# EAGLE schematic EEZ DIB DCP405 r4B2 (EAGLE 7.2.0)
Assembly variants: Farnell, TME

## Sheet 1 of 6: Power pre-regulator
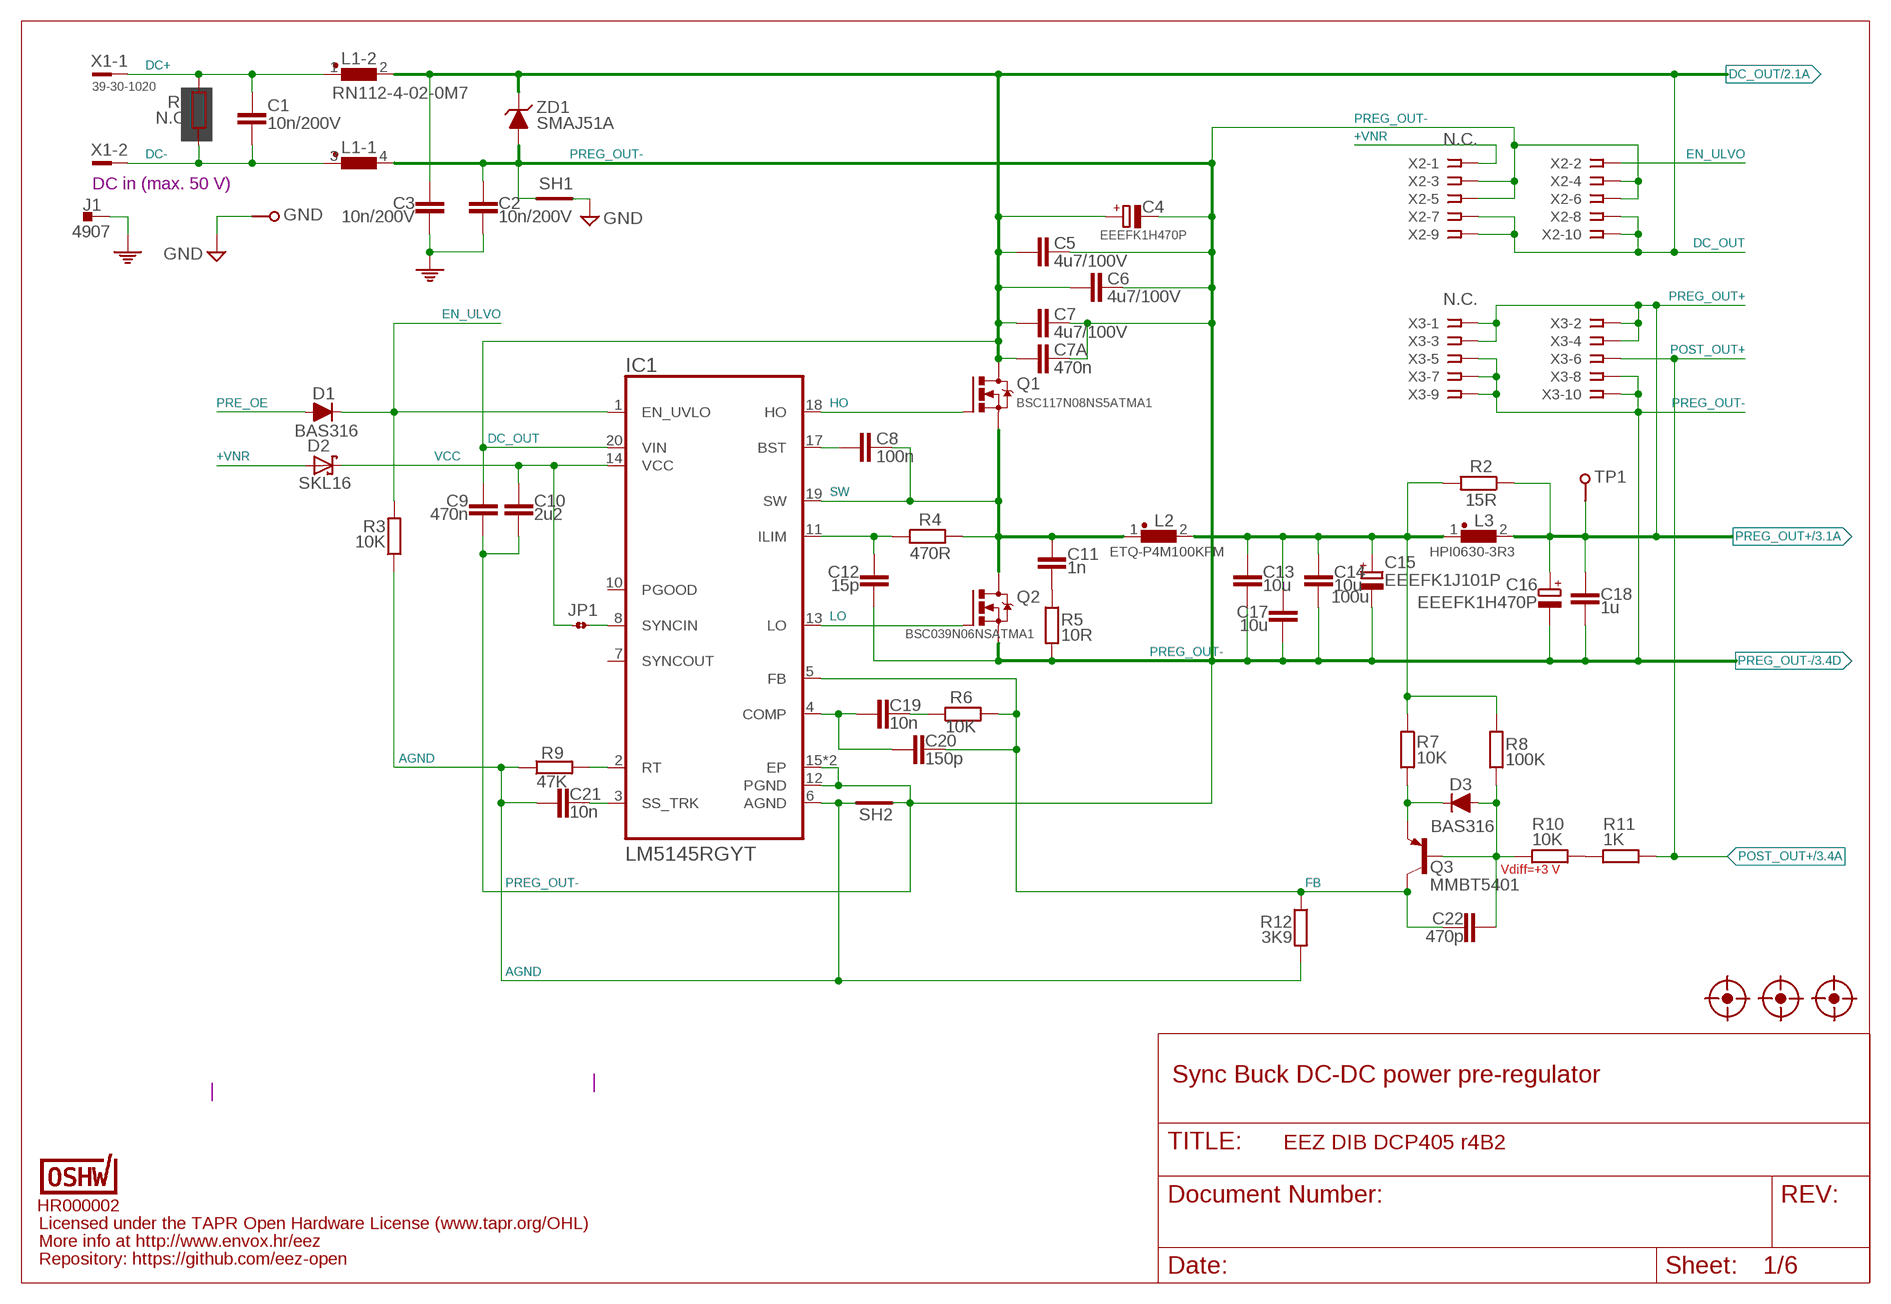
[diagram p0: schematic, sheet 1]

### Parts
C1  10n/200V  C-EUC1206  [C1206]
C2  10n/200V  C-EUC1206  [C1206]
C3  10n/200V  C-EUC1206  [C1206]
C4  EEEFK1H470P  ECAPSMD8.3MM/HA0  [CAPAE830X1050N]
C5  4u7/100V  C-EUC1210  [C1210]
C6  4u7/100V  C-EUC1210  [C1210]
C7  4u7/100V  C-EUC1210  [C1210]
C7A  470n  C-EUC0805  [C0805]
C8  100n  C-EUC0603  [C0603]
C9  470n  C-EUC0805  [C0805]
C10  2u2  C-EUC1206  [C1206]
C11  1n  C-EUC0805  [C0805]
C12  15p  C-EUC0805  [C0805]
C13  10u  C-EUC1210  [C1210]
C14  10u  C-EUC1210  [C1210]
C15  EEEFK1J101P  ECAP10X10  [CAPAE1030X1050N]
C16  EEEFK1H470P  ECAPSMD8.3MM/HA0  [CAPAE830X1050N]
C17  10u  C-EUC1210  [C1210]
C18  1u  C-EUC0805  [C0805]
C19  10n  C-EUC0805  [C0805]
C20  150p  C-EUC0805  [C0805]
C21  10n  C-EUC0805  [C0805]
C22  470p  C-EUC0805  [C0805]
D1  BAS316  DIODESOD323R  [SOD323-R]
D2  SKL16  SCHOTTKYSOD123  [SOD123]
D3  BAS316  DIODESOD323R  [SOD323-R]
FM1  FIDUCIAL_2  [FIDUCIAL_DUAL]
FM2  FIDUCIAL_2  [FIDUCIAL_DUAL]
FM3  FIDUCIAL_2  [FIDUCIAL_DUAL]
GND  PCB_TEST_TABSHIELD  [PCB_SHIELD_TAB]
IC1  LM5145RGYT  LM5145RGYR  [RGY0020B]
J1  4907  PCB_TAB-4907  [PCB_TAB-4907]
JP1  JP2-CUT-0805  [R_0805]
L1  RN112-4-02-0M7  RN112  [RN112]
L2  ETQ-P4M100KFM  PANASONIC_ETQ-P4_KFM  [PANASONIC_ETQ-P4_KFM]
L3  HPI0630-3R3  COILCRAFT_HPI0630  [COILCRAFT_HPI0630]
OSHWA  HR000002  OSHWA-CERT-SMALL  [CERT-SMALL-SILK]
Q1  BSC117N08NS5ATMA1  N-MOSFETTDSON-8  [TDSON-8]
Q2  BSC039N06NSATMA1  N-MOSFETTDSON-8  [TDSON-8]
Q3  MMBT5401  BC857B-PNP-SOT23-BEC  [SOT23-BEC]
R1  N.C.  R-EU_R2512  [R2512]
R2  15R  R-EU_R2010  [R2010]
R3  10K  R-EU_R0805  [R0805]
R4  470R  R-EU_R0805  [R0805]
R5  10R  R-EU_R1206  [R1206]
R6  10K  R-EU_R0805  [R0805]
R7  10K  R-EU_R0805  [R0805]
R8  100K  R-EU_R0805  [R0805]
R9  47K  R-EU_R0805  [R0805]
R10  10K  R-EU_R0805  [R0805]
R11  1K  R-EU_R0805  [R0805]
R12  3K9  R-EU_R0805  [R0805]
SH1  SHORTNOHOLE  [SHORT_NOHOLE]
SH2  SHORTNOHOLE  [SHORT_NOHOLE]
TP1  TEST-PIN_0.9MM  [TEST-PIN_0.9MM]
X1  39-30-1020  MINIFIT_39301020  [MINIFIT_39301020]
X2  N.C.  SSW-105-02-S-D  [SSW-105-02-S-D]
X3  N.C.  SSW-105-02-S-D  [SSW-105-02-S-D]
ZD1  SMAJ51A  P6SMB68A  [DO214AA]

### Nets
+VNR: D2.A X2.1 ; also sheet 2
AGND: C21.2 IC1.6(AGND) R3.1 R9.1 R12.2 SH2.1(GND_A)
DC+: C1.2 L1.1 R1.2 X1.1
DC-: C1.1 L1.3 R1.1 X1.2
DC_OUT: C3.2 C4.+ C5.1 C6.1 C7.1 C7A.2 C9.2 IC1.20(VIN) L1.2 Q1.5(D) Q1.6(D) Q1.7(D) Q1.8(D) X2.7 X2.8 X2.9 X2.10 ZD1.C ; also sheet 2,3
EN_ULVO: D1.C IC1.1(EN_UVLO) R3.2 X2.2
FB: C20.1 C22.1 IC1.5(FB) Q3.C R6.2 R12.1
GND: GND.1 SH1.2(GND_B) ; also sheet 2,3,4,5,6
HO: IC1.18(HO) Q1.4(G)
L_OUT: C13.1 C14.1 C15.+ C17.1 L2.2 L3.1 R2.2 R7.1 R8.1
LO: IC1.13(LO) Q2.4(G)
N$7: IC1.8(SYNCIN) JP1.2
N$8: R10.2 R11.1
N$16: D3.C Q3.E R7.2
N$38: C19.1 R6.1
N$40: C8.1 IC1.17(BST)
N$43: IC1.2(RT) R9.2
N$45: C19.2 C20.2 IC1.4(COMP)
N$46: C12.1 IC1.11(ILIM) R4.1
N$53: C21.1 IC1.3(SS_TRK)
N$59: C11.2 R5.2
N$79: C22.2 D3.A Q3.B R8.2 R10.1
PE: C2.2 C3.1 J1.1 J1.2 ; also sheet 4
POST_OUT+: R11.2 X3.6 ; also sheet 3,4,5
PRE_OE: D1.A ; also sheet 6
PREG_OUT+: C16.+ C18.2 L3.2 R2.1 TP1.1 X3.1 X3.2 X3.3 X3.4 ; also sheet 3
PREG_OUT-: C2.1 C4.- C5.2 C6.2 C7.2 C7A.1 C9.1 C10.1 C12.2 C13.2 C14.2 C15.- C16.- C17.2 C18.1 IC1.12(PGND) IC1.15(EP) IC1.21(EP) L1.4 Q2.1(S) Q2.2(S) Q2.3(S) R5.1 SH1.1(GND_A) SH2.2(GND_B) X2.3 X2.4 X2.5 X2.6 X3.5 X3.7 X3.8 X3.9 X3.10 ZD1.A ; also sheet 3
SW: C8.2 C11.1 IC1.19(SW) L2.1 Q1.1(S) Q1.2(S) Q1.3(S) Q2.5(D) Q2.6(D) Q2.7(D) Q2.8(D) R4.2
VCC: C10.2 D2.C IC1.14(VCC) JP1.1
Unconnected: IC1.7(SYNCOUT) IC1.10(PGOOD)

### Notes on the sheet
- DC in (max. 50 V)
- 100u
- Vdiff=+3 V
- Sync Buck DC-DC power pre-regulator
- Licensed under the TAPR Open Hardware License (www.tapr.org/OHL)
- More info at http://www.envox.hr/eez
- Repository: https://github.com/eez-open

## Sheet 2 of 6: Bias power, DIB interface
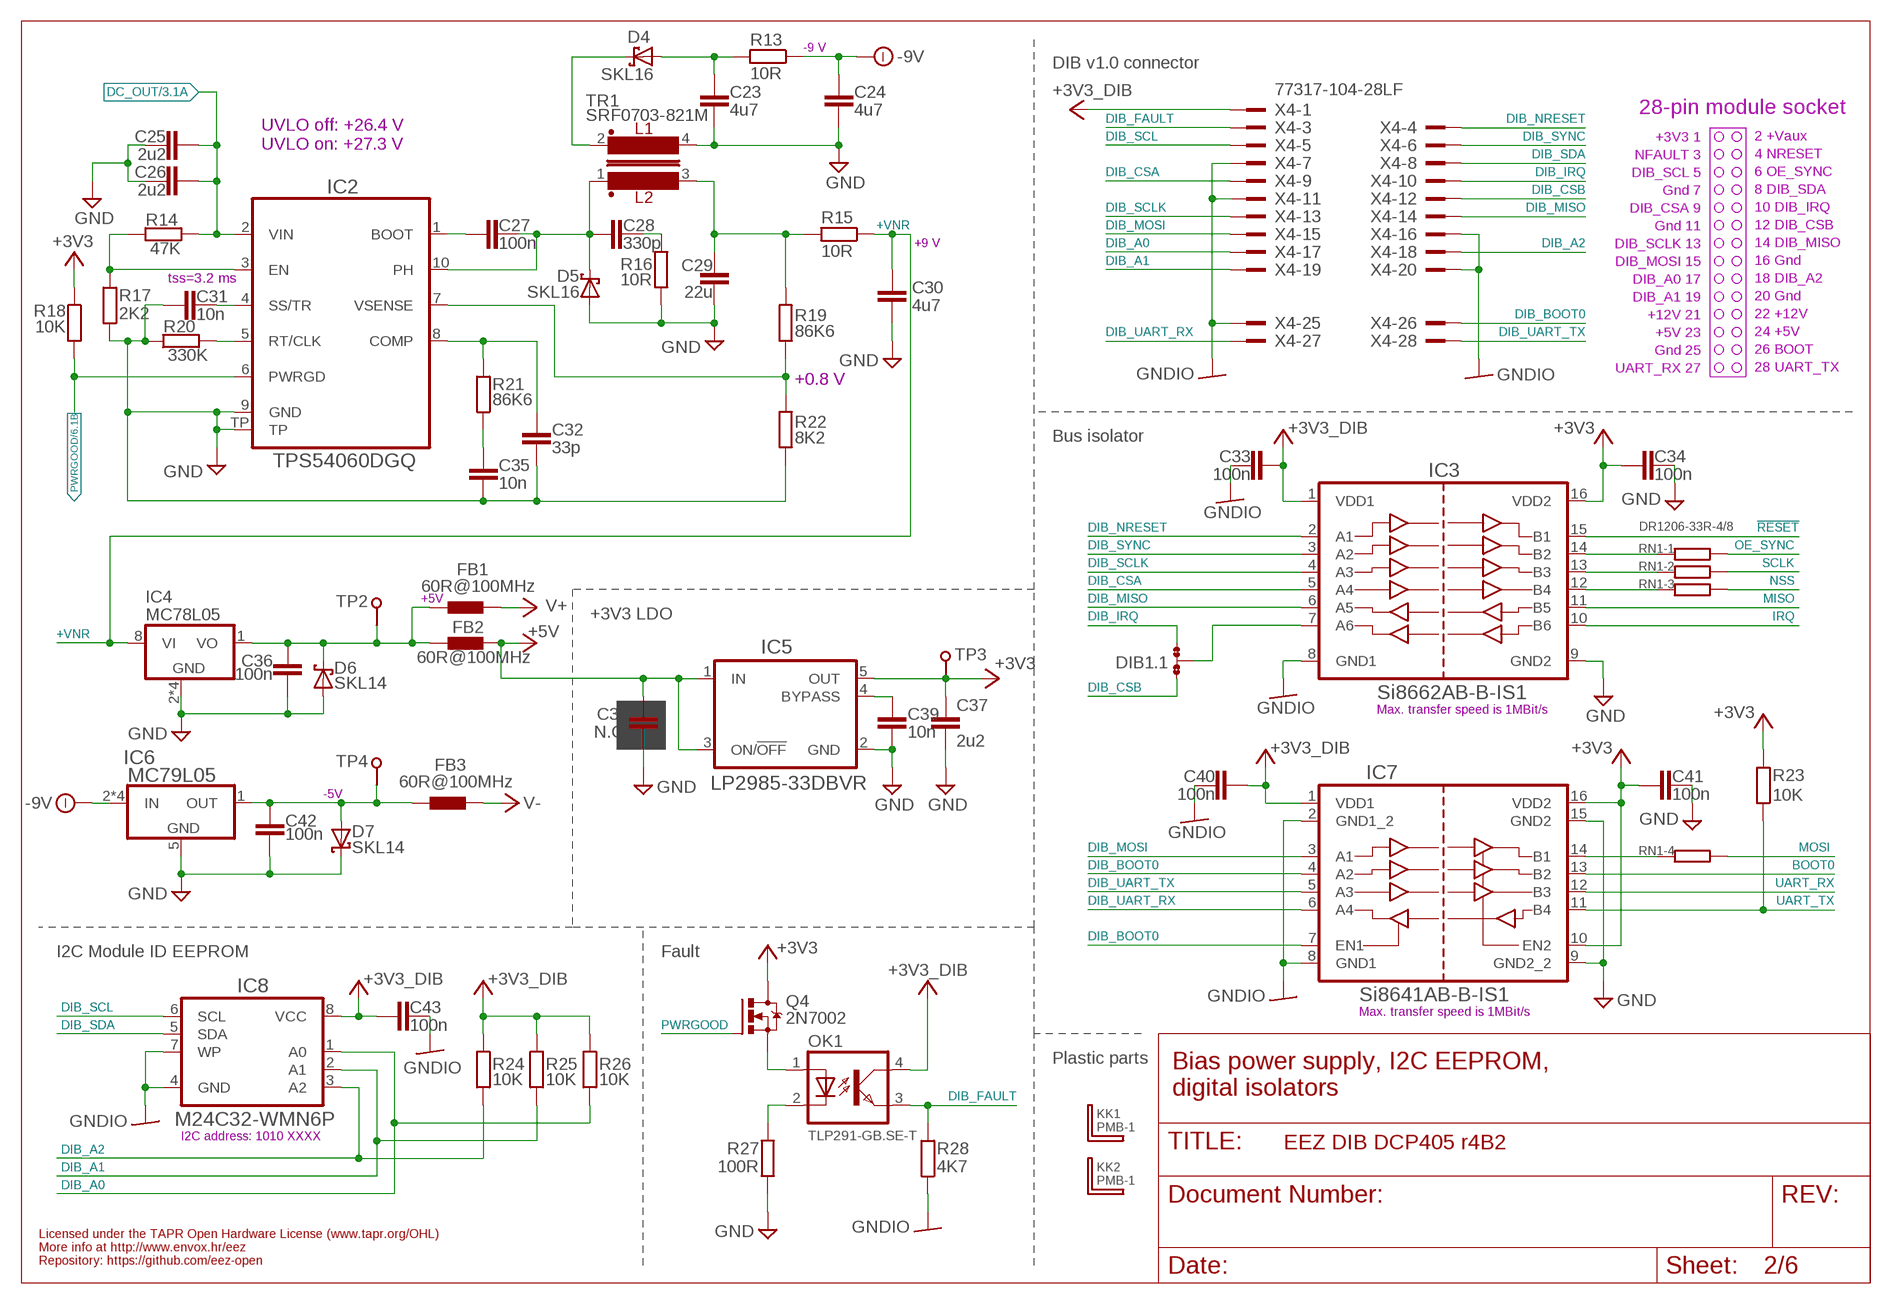
[diagram p1: schematic, sheet 2]

### Parts
C23  4u7  C-EUC1206  [C1206]
C24  4u7  C-EUC1206  [C1206]
C25  2u2  C-EUC1206  [C1206]
C26  2u2  C-EUC1206  [C1206]
C27  100n  C-EUC0603  [C0603]
C28  330p  C-EUC0805  [C0805]
C29  22u  C-EUC1210  [C1210]
C30  4u7  C-EUC1206  [C1206]
C31  10n  C-EUC0805  [C0805]
C32  33p  C-EUC0805  [C0805]
C33  100n  C-EUC0603  [C0603]
C34  100n  C-EUC0603  [C0603]
C35  10n  C-EUC0805  [C0805]
C36  100n  C-EUC0603  [C0603]
C37  2u2  C-EUC1206  [C1206]
C38  N.C.  C-EUC0805  [C0805]
C39  10n  C-EUC0805  [C0805]
C40  100n  C-EUC0603  [C0603]
C41  100n  C-EUC0603  [C0603]
C42  100n  C-EUC0603  [C0603]
C43  100n  C-EUC0603  [C0603]
D4  SKL16  SCHOTTKYSOD123  [SOD123]
D5  SKL16  SCHOTTKYSOD123  [SOD123]
D6  SKL14  SCHOTTKYSOD123  [SOD123]
D7  SKL14  SCHOTTKYSOD123  [SOD123]
DIB1.1  JP3-CUT-0805-ROTATED  [JP3-0805-CUT2]
FB1  60R@100MHz  FERRITE_BEAD0603  [BEAD0603]
FB2  60R@100MHz  FERRITE_BEAD0603  [BEAD0603]
FB3  60R@100MHz  FERRITE_BEAD0603  [BEAD0603]
IC2  TPS54060DGQ  [SOP50P490X110-11N]
IC3  Si8662AB-B-IS1  SI8662NSOIC-16  [SOIC-16]
IC4  MC78L05  MC78LXXSOIC8  [SOIC127P600X173-8N]
IC5  LP2985-33DBVR  LP2985  [SOT95P270X145-5N]
IC6  MC79L05  MC79LXXSOIC  [SOIC127P600X173-8N]
IC7  Si8641AB-B-IS1  SI8641NSOIC-16  [SOIC-16]
IC8  M24C32-WMN6P  AT24CXXSOIC8  [SOIC127P600X173-8N]
KK1  PMB-1  PCB-MB  [PCB-MB]
KK2  PMB-1  PCB-MB  [PCB-MB]
OK1  TLP291-GB.SE-T  TLP291  [SO4]
Q4  2N7002  [SOT103P240X110-3N]
R13  10R  R-EU_R1206  [R1206]
R14  47K  R-EU_R0805  [R0805]
R15  10R  R-EU_R1206  [R1206]
R16  10R  R-EU_R1206  [R1206]
R17  2K2  R-EU_R0805  [R0805]
R18  10K  R-EU_R0805  [R0805]
R19  86K6  R-EU_R0805  [R0805]
R20  330K  R-EU_R0805  [R0805]
R21  86K6  R-EU_R0805  [R0805]
R22  8K2  R-EU_R0805  [R0805]
R23  10K  R-EU_R0805  [R0805]
R24  10K  R-EU_R0805  [R0805]
R25  10K  R-EU_R0805  [R0805]
R26  10K  R-EU_R0805  [R0805]
R27  100R  R-EU_R0805  [R0805]
R28  4K7  R-EU_R0805  [R0805]
RN1  DR1206-33R-4/8  R_ARRAY4  [CAY16]
TP2  TEST-PIN_0.9MM  [TEST-PIN_0.9MM]
TP3  TEST-PIN_0.9MM  [TEST-PIN_0.9MM]
TP4  TEST-PIN_0.9MM  [TEST-PIN_0.9MM]
TR1  SRF0703-821M  BOURNS_SRF0703INV  [SRF0703]
X4  77317-104-28LF  [77317-104-28LF]

### Nets
!RESET: IC3.15(B1) ; also sheet 6
+3V3: C34.2 C37.1 C41.2 IC3.16(VDD2) IC5.5(OUT) IC7.10(EN2) IC7.16(VDD2) Q4.3(D) R18.1 R23.2 TP3.1 ; also sheet 3,4,5,6
+3V3_DIB: C33.1 C40.1 C43.2 IC3.1(VDD1) IC7.1(VDD1) IC8.8(VCC) OK1.4(COL) R24.1 R25.1 R26.1 X4.1
+5V: C38.2 FB2.P$2 IC5.1(IN) IC5.3(ON/!OFF) ; also sheet 4,5,6
+5VOUT: C36.1 D6.C FB1.P$1 FB2.P$1 IC4.1(VO) TP2.1
+VNR: C30.1 IC4.8(VI) R15.1 ; also sheet 1
-9V: C24.1 IC6.2(IN) IC6.3(IN) IC6.6(IN) IC6.7(IN) R13.1 ; also sheet 3
BOOT0: IC7.13(B2) ; also sheet 6
DC_OUT: C25.1 C26.1 IC2.2(VIN) R14.2 ; also sheet 1,3
DIB_A0: IC8.1(A0) R26.2 X4.17
DIB_A1: IC8.2(A1) R25.2 X4.19
DIB_A2: IC8.3(A2) R24.2 X4.18
DIB_BOOT0: IC7.4(A2) IC7.7(EN1) X4.26
DIB_CSA: IC3.5(A4) X4.9
DIB_CSB: DIB1.1.NO X4.12
DIB_FAULT: OK1.3(EMIT) R28.2 X4.3
DIB_IRQ: DIB1.1.NC X4.10
DIB_MISO: IC3.6(A5) X4.14
DIB_MOSI: IC7.3(A1) X4.15
DIB_NRESET: IC3.2(A1) X4.4
DIB_SCL: IC8.6(SCL) X4.5
DIB_SCLK: IC3.4(A3) X4.13
DIB_SDA: IC8.5(SDA) X4.8
DIB_SYNC: IC3.3(A2) X4.6
DIB_UART_RX: IC7.6(A4) X4.27
DIB_UART_TX: IC7.5(A3) X4.28
GND: C23.2 C24.2 C25.2 C26.2 C29.2 C30.2 C31.2 C32.1 C34.1 C35.1 C36.2 C37.2 C38.1 C39.1 C41.1 C42.1 D5.A D6.A D7.C IC2.9(GND) IC2.TP IC3.9(GND2) IC4.2(GND) IC4.3(GND) IC4.6(GND) IC4.7(GND) IC5.2(GND) IC6.5(GND) IC7.9(GND2_2) IC7.15(GND2) R16.1 R17.1 R20.1 R22.1 R27.1 TR1.4 ; also sheet 1,3,4,5,6
GNDIO: C33.2 C40.2 C43.1 IC3.8(GND1) IC7.2(GND1_2) IC7.8(GND1) IC8.4(GND) IC8.7(WP) R28.1 X4.7 X4.11 X4.16 X4.20 X4.25
IRQ: IC3.10(B6) ; also sheet 6
MISO: IC3.11(B5) ; also sheet 6
MOSI: RN1.5 ; also sheet 6
N$25: C39.2 IC5.4(BYPASS)
N$26: C28.2 R16.2
N$29: C42.2 D7.A FB3.P$1 IC6.1(OUT) TP4.1
N$34: IC2.3(EN) R14.1 R17.2
N$41: C31.1 IC2.4(SS/TR)
N$48: IC2.5(RT/CLK) R20.2
N$50: C32.2 IC2.8(COMP) R21.2
N$51: C35.2 R21.1
N$60: C27.2 IC2.1(BOOT)
N$62: IC2.7(VSENSE) R19.1 R22.2
N$72: OK1.2(C) R27.2
N$78: OK1.1(A) Q4.2(S)
N$110: IC3.14(B2) RN1.1
N$111: IC3.13(B3) RN1.2
N$112: IC3.12(B4) RN1.3
N$153: IC7.14(B1) RN1.4
N$179: C23.1 D4.A R13.2
N$2424: DIB1.1.COM IC3.7(A6)
NSS: RN1.6 ; also sheet 6
OE_SYNC: RN1.8 ; also sheet 6
PH: C27.1 C28.1 D5.C IC2.10(PH) TR1.1
PWRGOOD: IC2.6(PWRGD) Q4.1(G) R18.2 ; also sheet 6
SCLK: RN1.7 ; also sheet 6
UART_RX: IC7.12(B3) ; also sheet 6
UART_TX: IC7.11(B4) R23.1 ; also sheet 6
V+: FB1.P$2 ; also sheet 3,4,5,6
V-: FB3.P$2 ; also sheet 3,4,5
VOUT+: C29.1 R15.2 R19.2 TR1.3
VOUT-: D4.C TR1.2
Unconnected: X4.2 X4.21 X4.22 X4.23 X4.24

### Notes on the sheet
- -9 V
- DIB v1.0 connector
- 28-pin module socket
- +3V3 1
- 2 +Vaux
- UVLO off: +26.4 V
  UVLO on: +27.3 V
- NFAULT 3
- 4 NRESET
- DIB_SCL 5
- 6 OE_SYNC
- Gnd 7
- 8 DIB_SDA
- DIB_CSA 9
- 10 DIB_IRQ
- Gnd 11
- 12 DIB_CSB
- +9 V | DIB_SCLK 13
- 14 DIB_MISO
- DIB_MOSI 15
- 16 Gnd
- DIB_A0 17
- tss=3.2 ms | 18 DIB_A2
- DIB_A1 19
- 20 Gnd
- +12V 21
- 22 +12V
- +5V 23
- 24 +5V
- Gnd 25
- 26 BOOT
- UART_RX 27
- 28 UART_TX
- +0.8 V
- Bus isolator
- +5V
- +3V3 LDO
- Max. transfer speed is 1MBit/s
- -5V
- I2C Module ID EEPROM | Fault
- Max. transfer speed is 1MBit/s
- Plastic parts
- Bias power supply, I2C EEPROM,
  digital isolators
- I2C address: 1010 XXXX
- Licensed under the TAPR Open Hardware License (www.tapr.org/OHL)
- More info at http://www.envox.hr/eez
- Repository: https://github.com/eez-open

## Sheet 3 of 6: Post-regulator
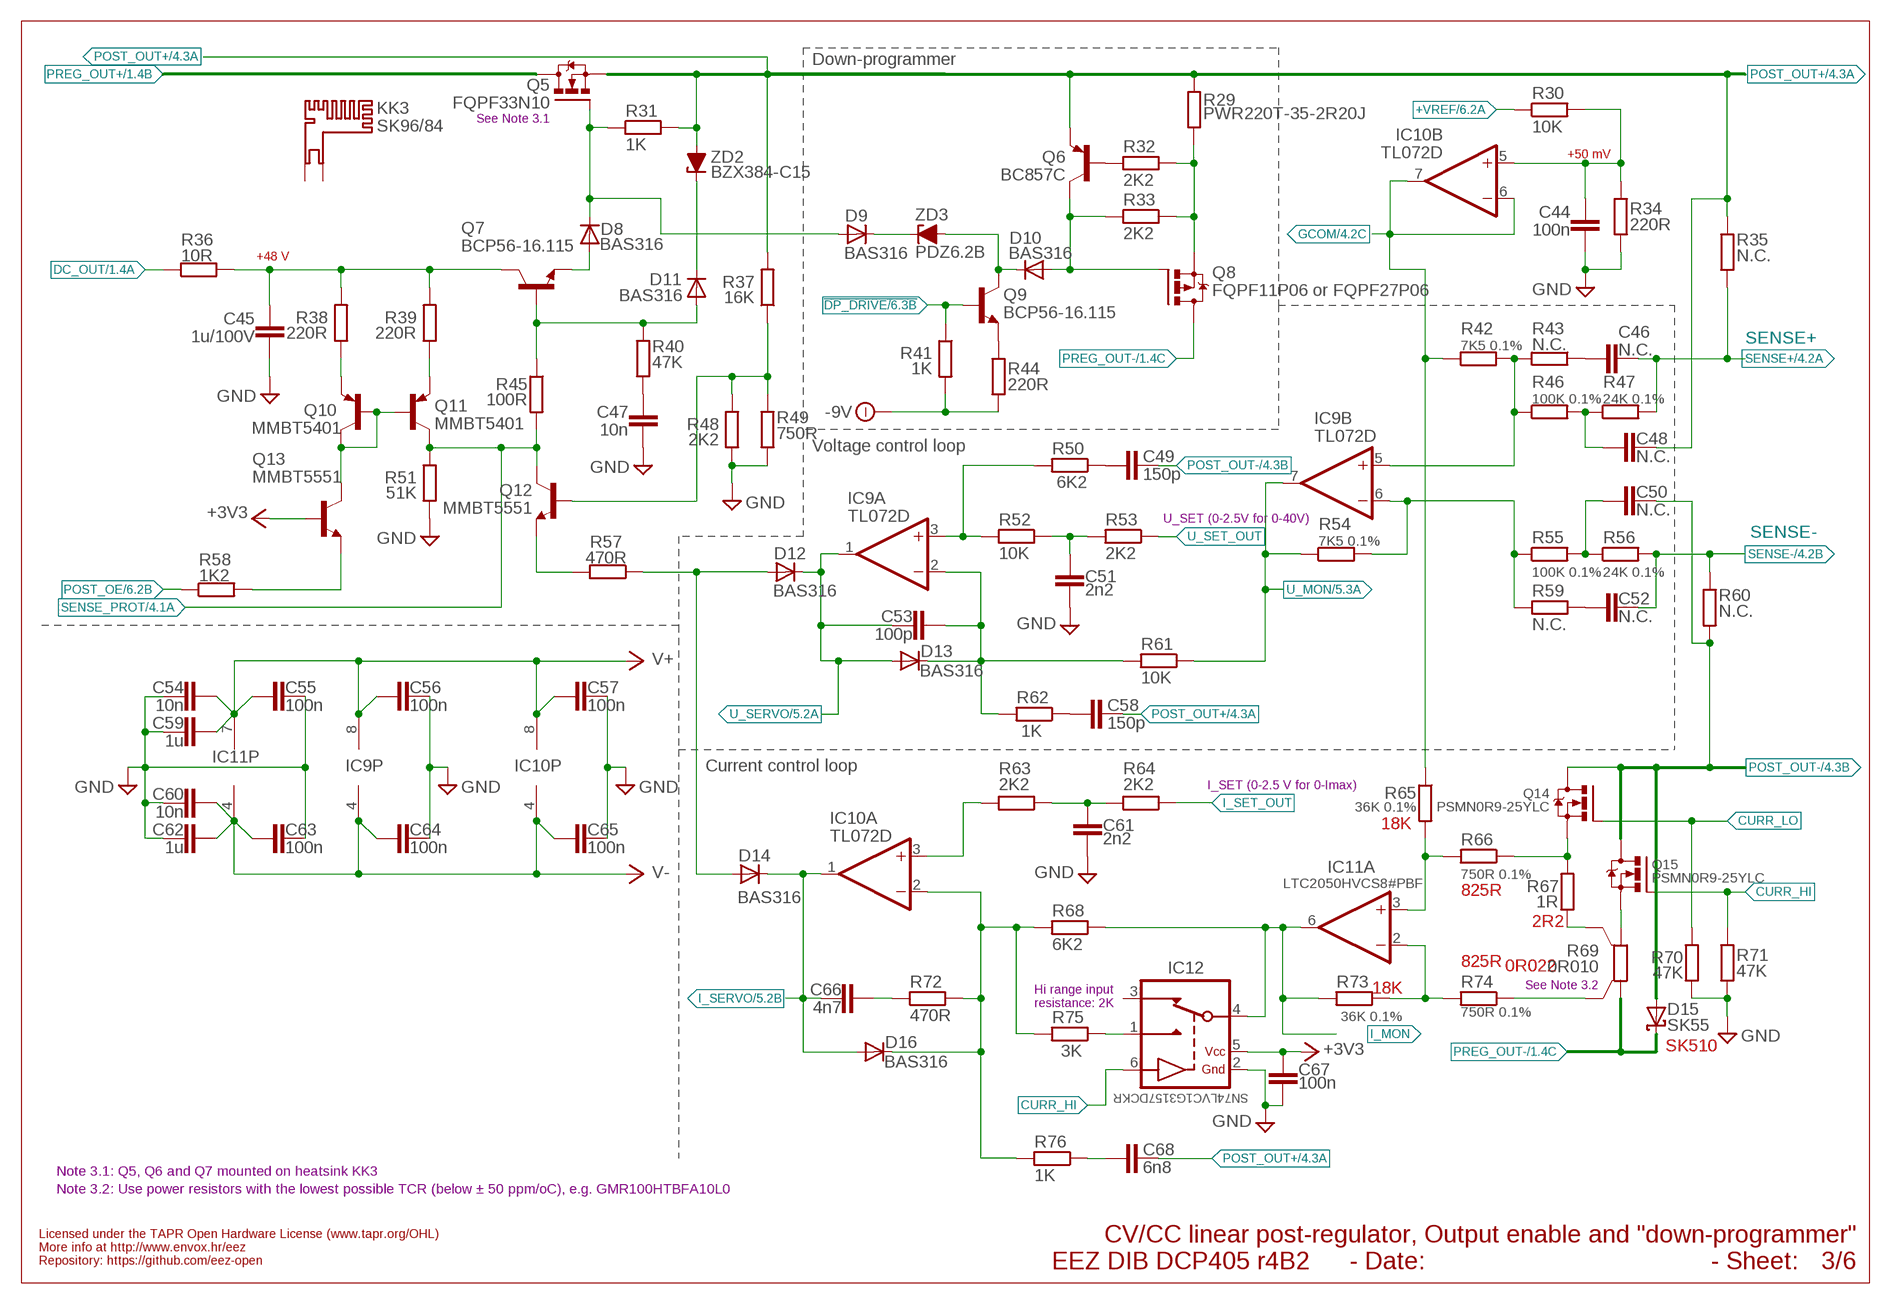
[diagram p2: schematic, sheet 3]

### Parts
C44  100n  C-EUC0603  [C0603]
C45  1u/100V  C-EUC1206  [C1206]
C46  N.C.  C-EUC0805  [C0805]
C47  10n  C-EUC0805  [C0805]
C48  N.C.  C-EUC0805  [C0805]
C49  150p  C-EUC0805  [C0805]
C50  N.C.  C-EUC0805  [C0805]
C51  2n2  C-EUC0805  [C0805]
C52  N.C.  C-EUC0805  [C0805]
C53  100p  C-EUC0805  [C0805]
C54  10n  C-EUC0805  [C0805]
C55  100n  C-EUC0603  [C0603]
C56  100n  C-EUC0603  [C0603]
C57  100n  C-EUC0603  [C0603]
C58  150p  C-EUC0805  [C0805]
C59  1u  C-EUC0805  [C0805]
C60  10n  C-EUC0805  [C0805]
C61  2n2  C-EUC0805  [C0805]
C62  1u  C-EUC0805  [C0805]
C63  100n  C-EUC0603  [C0603]
C64  100n  C-EUC0603  [C0603]
C65  100n  C-EUC0603  [C0603]
C66  4n7  C-EUC0805  [C0805]
C67  100n  C-EUC0603  [C0603]
C68  6n8  C-EUC0805  [C0805]
D8  BAS316  DIODE-SOD323-W  [SOD323-W]
D9  BAS316  DIODE-SOD323-W  [SOD323-W]
D10  BAS316  DIODE-SOD323-W  [SOD323-W]
D11  BAS316  DIODE-SOD323-W  [SOD323-W]
D12  BAS316  DIODE-SOD323-W  [SOD323-W]
D13  BAS316  DIODE-SOD323-W  [SOD323-W]
D14  BAS316  DIODE-SOD323-W  [SOD323-W]
D15  SK55  SCHOTTKYSMB  [SMB]
D16  BAS316  DIODE-SOD323-W  [SOD323-W]
IC9  TL072D  TL072SOIC8  [SOIC127P600X173-8N]
IC10  TL072D  TL072SOIC8  [SOIC127P600X173-8N]
IC11  LTC2050HVCS8#PBF  OP27GSZSO8  [SOIC127P600X173-8N]
IC12  SN74LVC1G3157DCKR  SN74LVC1G3157-DCK  [SOT65P210X110-6N]
KK3  SK96/84  [SK96/84]
Q5  FQPF33N10  N-MOSFET-FPV  [TO220FP-V]
Q6  BC857C  BC857C-PNP-SOT23-BEC  [SOT23-BEC]
Q7  BCP56-16.115  BCP56  [SOT230P700X180-4N]
Q8  FQPF11P06 or FQPF27P06  P-MOSFET-FPV  [TO220FP-V]
Q9  BCP56-16.115  BCP56  [SOT230P700X180-4N]
Q10  MMBT5401  BC857B-PNP-SOT23-BEC  [SOT23-BEC]
Q11  MMBT5401  BC857B-PNP-SOT23-BEC  [SOT23-BEC]
Q12  MMBT5551  MMBT5551LT1-NPN-SOT23-BEC  [SOT23-BEC]
Q13  MMBT5551  MMBT5551LT1-NPN-SOT23-BEC  [SOT23-BEC]
Q14  PSMN0R9-25YLC  N-MOSFETLFPAK  [SOT669]
Q15  PSMN0R9-25YLC  N-MOSFETLFPAK  [SOT669]
R29  PWR220T-35-2R20J  R_EU_PWR220T-35  [TO220-2R]
R30  10K  R-EU_R0805  [R0805]
R31  1K  R-EU_R0805  [R0805]
R32  2K2  R-EU_R0805  [R0805]
R33  2K2  R-EU_R0805  [R0805]
R34  220R  R-EU_R0805  [R0805]
R35  N.C.  R-EU_R0805  [R0805]
R36  10R  R-EU_R1206  [R1206]
R37  16K  R-EU_R0805  [R0805]
R38  220R  R-EU_R0805  [R0805]
R39  220R  R-EU_R0805  [R0805]
R40  47K  R-EU_R0805  [R0805]
R41  1K  R-EU_R0805  [R0805]
R42  7K5 0.1%  R-EU_R0805  [R0805]
R43  N.C.  R-EU_R0805  [R0805]
R44  220R  R-EU_R0805  [R0805]
R45  100R  R-EU_R0805  [R0805]
R46  100K 0.1%  R-EU_R0805  [R0805]
R47  24K 0.1%  R-EU_R0805  [R0805]
R48  2K2  R-EU_R0805  [R0805]
R49  750R  R-EU_R0805  [R0805]
R50  6K2  R-EU_R0805  [R0805]
R51  51K  R-EU_R0805  [R0805]
R52  10K  R-EU_R0805  [R0805]
R53  2K2  R-EU_R0805  [R0805]
R54  7K5 0.1%  R-EU_R0805  [R0805]
R55  100K 0.1%  R-EU_R0805  [R0805]
R56  24K 0.1%  R-EU_R0805  [R0805]
R57  470R  R-EU_R0805  [R0805]
R58  1K2  R-EU_R0805  [R0805]
R59  N.C.  R-EU_R0805  [R0805]
R60  N.C.  R-EU_R0805  [R0805]
R61  10K  R-EU_R0805  [R0805]
R62  1K  R-EU_R0805  [R0805]
R63  2K2  R-EU_R0805  [R0805]
R64  2K2  R-EU_R0805  [R0805]
R65  36K 0.1%  R-EU_R0805  [R0805]
R66  750R 0.1%  R-EU_R0805  [R0805]
R67  1R  R-EU_R1206  [R1206]
R68  6K2  R-EU_R0805  [R0805]
R69  0R010  R-EU_4WIRE2512  [R_2512-4WIRE]
R70  47K  R-EU_R0805  [R0805]
R71  47K  R-EU_R0805  [R0805]
R72  470R  R-EU_R0805  [R0805]
R73  36K 0.1%  R-EU_R0805  [R0805]
R74  750R 0.1%  R-EU_R0805  [R0805]
R75  3K  R-EU_R0805  [R0805]
R76  1K  R-EU_R0805  [R0805]
ZD2  BZX384-C15  ZENER-DIODESOD323  [SOD323-W]
ZD3  PDZ6.2B  ZENER-DIODESOD323  [SOD323-W]

### Nets
!DP_DRIVE: Q9.1(B) R41.1 ; also sheet 6
+3V3: C67.1 IC12.5(VDD) Q13.B ; also sheet 2,4,5,6
+VREF: R30.1 ; also sheet 6
-9V: R41.2 R44.2 ; also sheet 2
CURR_HI: IC12.6(CTRL) Q15.4(G) R71.2 ; also sheet 6
CURR_LO: Q14.4(G) R70.2 ; also sheet 6
DC_BIAS: C45.1 Q7.2(C) Q7.4(C) R36.2 R38.2 R39.2
DC_OUT: R36.1 ; also sheet 1,2
GCOM: IC10.6(B:-IN) IC10.7(B:OUT) R42.1 R65.1 ; also sheet 4
GND: C44.2 C45.2 C47.2 C51.2 C54.1 C55.2 C56.1 C57.1 C59.1 C60.1 C61.2 C62.1 C63.2 C64.1 C65.1 C67.2 IC12.2(GND) R34.2 R48.1 R49.1 R51.1 R70.1 R71.1 ; also sheet 1,2,4,5,6
I_MON: IC11.6(A:OUT) IC12.4(COM) R68.1 R73.2 ; also sheet 6
I_SERVO: C66.2 D14.C D16.A IC10.1(A:OUT) ; also sheet 5
I_SET_OUT: R64.1 ; also sheet 4
ISENSE+: IC11.3(A:+IN) R65.2 R66.2
ISENSE-: IC11.2(A:-IN) R73.1 R74.2
LOOP_CTRL: D12.A D14.A R57.1 ; also sheet 5
N$10: C61.1 R63.1 R64.2
N$11: IC9.3(A:+IN) R50.2 R52.2
N$14: C53.1 D13.C IC9.2(A:-IN) R61.2 R62.2
N$17: C50.1 R55.2 R56.1
N$36: C48.1 R46.2 R47.1
N$37: C46.2 R43.1
N$42: IC12.1(NO) R75.1
N$52: IC10.3(A:+IN) R63.2
N$54: C52.2 R59.1
N$57: C68.2 R76.1
N$58: D16.C IC10.2(A:-IN) R68.2 R72.2 R75.2 R76.2
N$61: C51.1 R52.1 R53.2
N$65: C49.2 R50.1
N$82: C58.2 R62.1
N$83: D8.C D9.A Q5.1(G) R31.1
N$84: D8.A Q7.3(E)
N$85: D11.A Q7.1(B) R40.2 R45.1
N$86: D11.C ZD2.C
N$87: C47.1 R40.1
N$88: D9.C ZD3.C
N$89: Q8.3(S) R29.1 R32.1 R33.1
N$90: D10.A Q6.C Q8.1(G) R33.2
N$91: Q12.E R57.2
N$92: Q11.E R39.1
N$93: Q10.E R38.1
N$95: Q13.E R58.2
N$96: Q12.B R37.1 R48.2 R49.2
N$97: Q9.3(E) R44.1
N$98: Q6.B R32.2
N$105: C66.1 R72.1
N$106: C44.1 IC10.5(B:+IN) R30.2 R34.1
N$107: Q14.1(S) Q14.2(S) Q14.3(S) R66.1 R67.2
N$108: R67.1 R69.2S
N$150: IC9.5(B:+IN) R42.2 R43.2 R46.1
N$158: IC9.6(B:-IN) R54.2 R55.1 R59.2
N$200: R69.1S R74.1
POST_OE: R58.1 ; also sheet 6
POST_OUT+: C48.2 C58.1 C68.1 Q5.3(S) Q6.E R29.2 R31.2 R35.1 R37.2 ZD2.A ; also sheet 1,4,5
POST_OUT-: C49.1 C50.2 D15.A Q14.MB(D) Q15.MB(D) R60.2 ; also sheet 4,5
PREG_OUT+: Q5.2(D) ; also sheet 1
PREG_OUT-: D15.C Q8.2(D) R69.1 ; also sheet 1
Q7C1: Q10.B Q10.C Q11.B Q13.C
Q8C: D10.C Q9.2(C) Q9.4(C) ZD3.A
Q14S: Q15.1(S) Q15.2(S) Q15.3(S) R69.2
SENSE+: C46.1 R35.2 R47.2 ; also sheet 4
SENSE-: C52.1 R56.2 R60.1 ; also sheet 4
SENSE_PROT: Q11.C Q12.C R45.2 R51.2 ; also sheet 4
U_MON: IC9.7(B:OUT) R54.1 R61.1 ; also sheet 5,6
U_SERVO: C53.2 D12.C D13.A IC9.1(A:OUT) ; also sheet 5
U_SET_OUT: R53.1 ; also sheet 4
V+: C54.2 C55.1 C56.2 C57.2 C59.2 IC9.8(P:V+) IC10.8(P:V+) IC11.7(P:V+) ; also sheet 2,4,5,6
V-: C60.2 C62.2 C63.1 C64.2 C65.2 IC9.4(P:V-) IC10.4(P:V-) IC11.4(P:V-) ; also sheet 2,4,5
Unconnected: IC12.3(NC) KK3.1 KK3.2

### Notes on the sheet
- Down-programmer
- See Note 3.1
- +50 mV
- +48 V
- Voltage control loop
- U_SET (0-2.5V for 0-40V)
- Current control loop
- I_SET (0-2.5 V for 0-Imax)
- 18K
- 825R
- 2R2
- 825R | 0R022
- See Note 3.2
- 18K
- Hi range input
  resistance: 2K
- SK510
- Note 3.1: Q5, Q6 and Q7 mounted on heatsink KK3
- Note 3.2: Use power resistors with the lowest possible TCR (below ± 50 ppm/oC), e.g. GMR100HTBFA10L0
- Licensed under the TAPR Open Hardware License (www.tapr.org/OHL)
- CV/CC linear post-regulator, Output enable and "down-programmer"
- More info at http://www.envox.hr/eez
- Repository: https://github.com/eez-open
- - Date: | - Sheet:

## Sheet 4 of 6: Rsense protection, power output
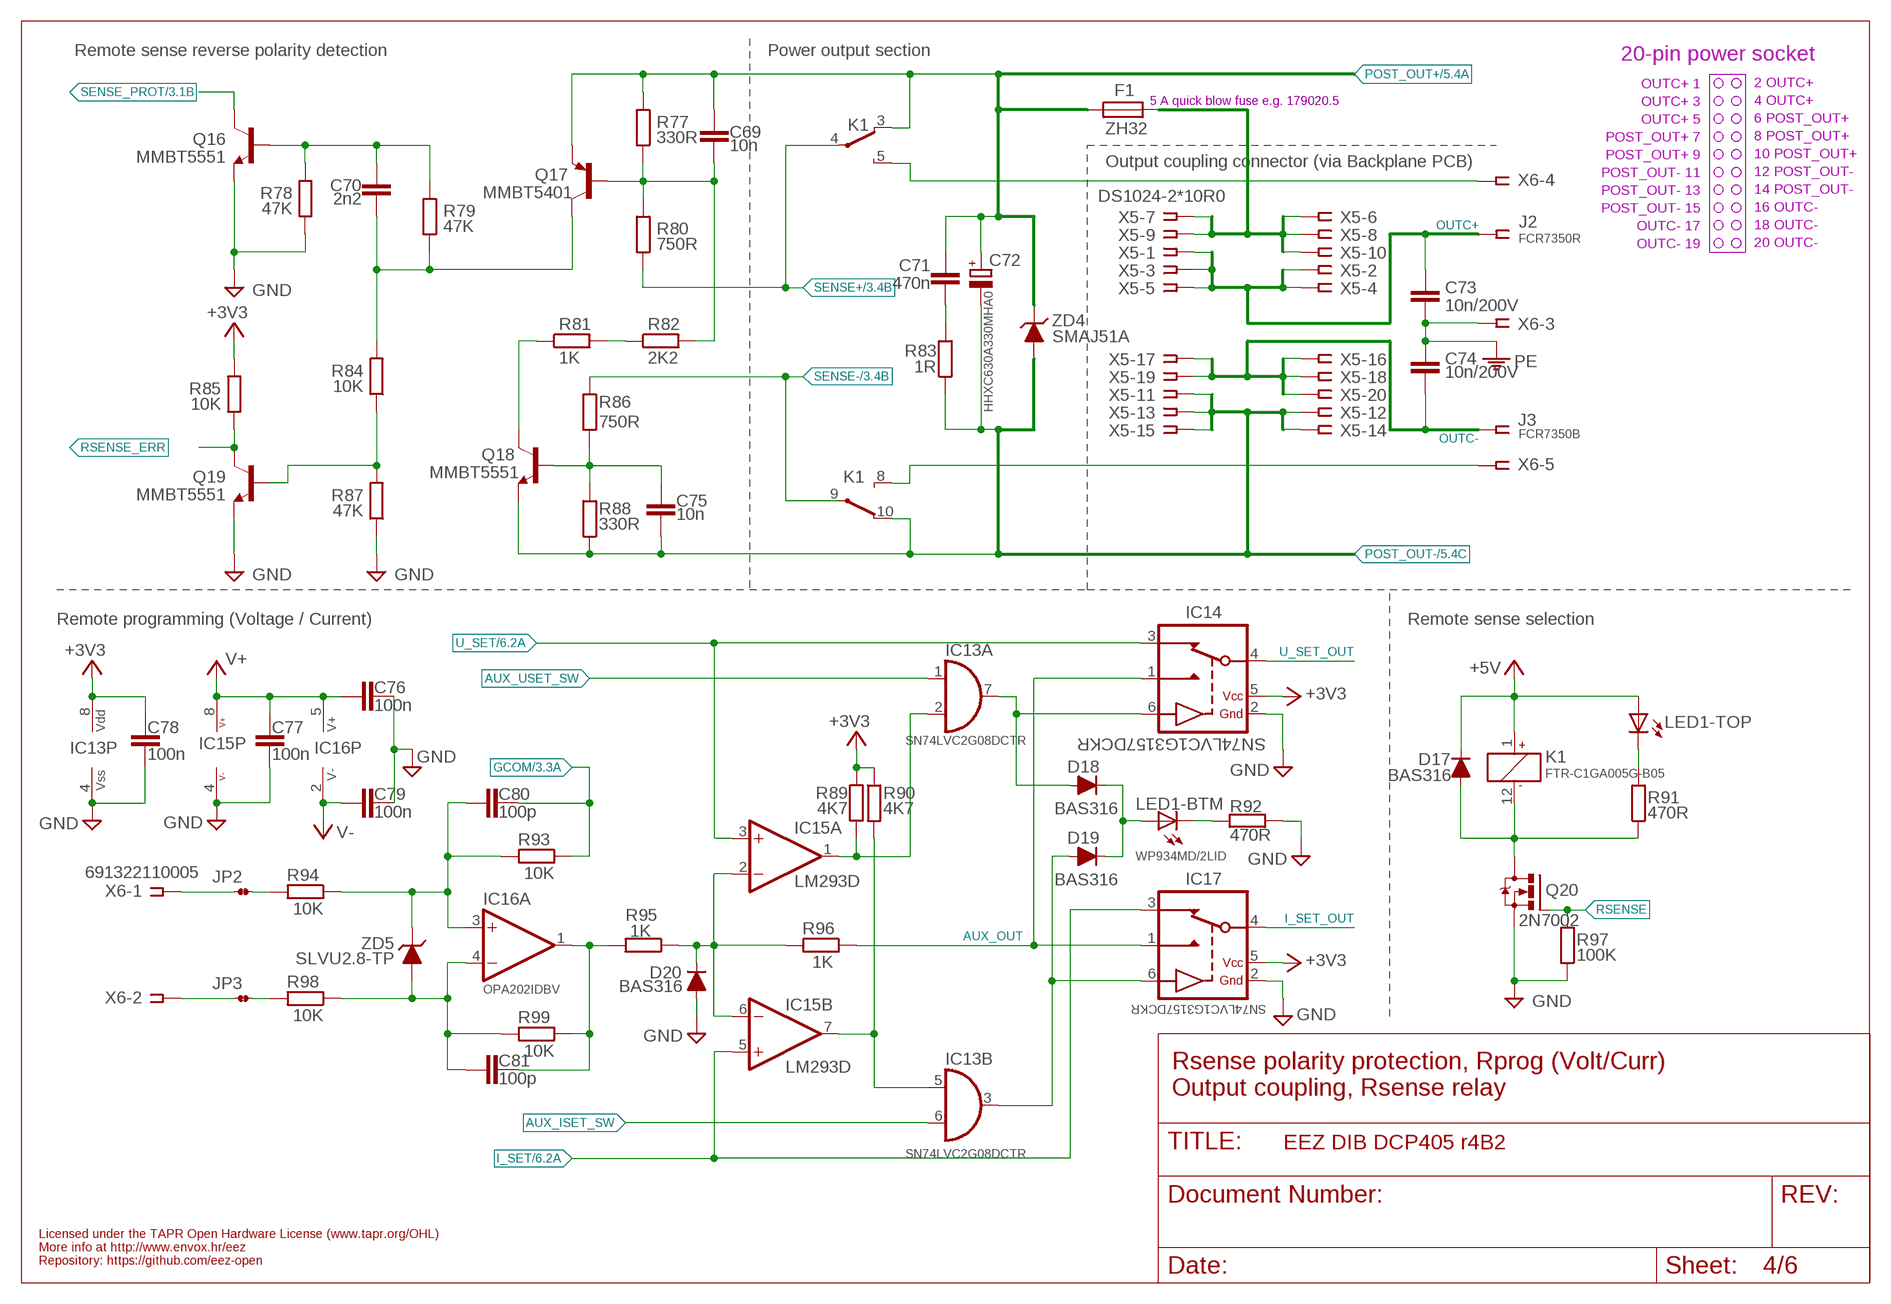
[diagram p3: schematic, sheet 4]

### Parts
C69  10n  C-EUC0805  [C0805]
C70  2n2  C-EUC0805  [C0805]
C71  470n  C-EUC0805  [C0805]
C72  HHXC630A330MHA0  ECAPSMD8.3MM/HA0  [CAPAE830X1050N]
C73  10n/200V  C-EUC1206  [C1206]
C74  10n/200V  C-EUC1206  [C1206]
C75  10n  C-EUC0805  [C0805]
C76  100n  C-EUC0603  [C0603]
C77  100n  C-EUC0603  [C0603]
C78  100n  C-EUC0603  [C0603]
C79  100n  C-EUC0603  [C0603]
C80  100p  C-EUC0805  [C0805]
C81  100p  C-EUC0805  [C0805]
D17  BAS316  DIODESOD323R  [SOD323-R]
D18  BAS316  DIODESOD323R  [SOD323-R]
D19  BAS316  DIODESOD323R  [SOD323-R]
D20  BAS316  DIODESOD323R  [SOD323-R]
F1  ZH32  [ZH32]
IC13  SN74LVC2G08DCTR  [DCT8]
IC14  SN74LVC1G3157DCKR  SN74LVC1G3157-DCK  [SOT65P210X110-6N]
IC15  LM293D  [SOIC127P600X173-8N]
IC16  OPA202IDBV  OPA376AIDBVR  [DBV5]
IC17  SN74LVC1G3157DCKR  SN74LVC1G3157-DCK  [SOT65P210X110-6N]
J2  FCR7350R  BINDING_POSTCLIFF  [S16N-PC]
J3  FCR7350B  BINDING_POSTCLIFF  [S16N-PC]
JP2  JP2-NOCUT-0805  [JP2-0805-NOCUT]
JP3  JP2-NOCUT-0805  [JP2-0805-NOCUT]
K1  FTR-C1GA005G-B05  FTR-C1  [FTR-C1]
LED1  WP934MD/2LID  [WP934MD]
Q16  MMBT5551  MMBT5551LT1-NPN-SOT23-BEC  [SOT23-BEC]
Q17  MMBT5401  BC857B-PNP-SOT23-BEC  [SOT23-BEC]
Q18  MMBT5551  MMBT5551LT1-NPN-SOT23-BEC  [SOT23-BEC]
Q19  MMBT5551  MMBT5551LT1-NPN-SOT23-BEC  [SOT23-BEC]
Q20  2N7002  [SOT103P240X110-3N]
R77  330R  R-EU_R0805  [R0805]
R78  47K  R-EU_R0805  [R0805]
R79  47K  R-EU_R0805  [R0805]
R80  750R  R-EU_R0805  [R0805]
R81  1K  R-EU_R0805  [R0805]
R82  2K2  R-EU_R0805  [R0805]
R83  1R  R-EU_R1206  [R1206]
R84  10K  R-EU_R0805  [R0805]
R85  10K  R-EU_R0805  [R0805]
R86  750R  R-EU_R0805  [R0805]
R87  47K  R-EU_R0805  [R0805]
R88  330R  R-EU_R0805  [R0805]
R89  4K7  R-EU_R0805  [R0805]
R90  4K7  R-EU_R0805  [R0805]
R91  470R  R-EU_R0805  [R0805]
R92  470R  R-EU_R0805  [R0805]
R93  10K  R-EU_R0805  [R0805]
R94  10K  R-EU_R0805  [R0805]
R95  1K  R-EU_R0805  [R0805]
R96  1K  R-EU_R0805  [R0805]
R97  100K  R-EU_R0805  [R0805]
R98  10K  R-EU_R0805  [R0805]
R99  10K  R-EU_R0805  [R0805]
X5  DS1024-2*10R0  SSW-110-02-T-D-RA  [SSW-110-02-T-D-RA]
X6  691322110005  MC1,5/5-G-3,5  [MC1,5/5-G-3,5]
ZD4  SMAJ51A  P6SMB68A  [DO214AA]
ZD5  SLVU2.8-TP  SLVU2.8  [SOT23]

### Nets
+3V3: C78.2 IC13.8(P:VDD) IC14.5(VDD) IC17.5(VDD) R85.2 R89.1 R90.1 ; also sheet 2,3,5,6
+5V: D17.C K1.1(C1) LED1.TA(-TOP:A) ; also sheet 2,5,6
AUX_IN+: C80.2 IC16.3(A:+IN) R93.2 R94.1 ZD5.3(C)
AUX_IN-: C81.2 IC16.4(A:-IN) R98.1 R99.2 ZD5.1(A) ZD5.2(A)
AUX_ISET_SW: IC13.6(B:I1) ; also sheet 6
AUX_OUT: IC14.1(NO) IC17.1(NO) R96.1
AUX_USET_SW: IC13.1(A:I0) ; also sheet 6
GCOM: C80.1 R93.1 ; also sheet 3
GND: C76.2 C77.2 C78.1 C79.2 D20.A IC13.4(P:VSS) IC14.2(GND) IC15.4(P:V-) IC17.2(GND) Q16.E Q19.E Q20.2(S) R78.1 R87.1 R92.1 R97.1 ; also sheet 1,2,3,5,6
I_SET: IC15.5(B:+IN) IC17.3(NC) ; also sheet 6
I_SET_OUT: IC17.4(COM) ; also sheet 3
N$2: JP3.1 X6.2
N$4: D20.C IC15.2(A:-IN) IC15.6(B:-IN) R95.1 R96.2
N$6: C81.1 IC16.1(A:OUT) R95.2 R99.1
N$9: D18.C D19.C LED1.BA(-BTM:A)
N$31: JP2.2 R94.2
N$32: JP2.1 X6.1
N$35: JP3.2 R98.2
N$39: IC13.2(A:I1) IC15.1(A:OUT) R89.2
N$47: IC13.5(B:I0) IC15.7(B:OUT) R90.2
N$49: D18.A IC13.7(A:O) IC14.6(CTRL)
N$55: D19.A IC13.3(B:O) IC17.6(CTRL)
N$113: C71.2 R83.2
N$114: D17.A K1.12(C2) Q20.3(D) R91.1
N$115: K1.5(-1:NO) X6.4
N$116: K1.8(-2:NO) X6.5
N$120: LED1.TC(-TOP:C) R91.2
N$121: LED1.BC(-BTM:C) R92.2
N$1697: C69.2 Q17.B R77.1 R80.2 R82.2
N$1698: C70.2 Q17.C R79.1 R84.2
N$1699: Q18.C R81.1
N$1700: C75.1 Q18.B R86.1 R88.2
N$1701: C70.1 Q16.B R78.2 R79.2
N$1702: Q19.B R84.1 R87.2
N$1703: R81.2 R82.1
OUTC+: C73.1 J2.1 X5.1 X5.2 X5.3 X5.4 X5.5
OUTC-: C74.2 J3.1 X5.16 X5.17 X5.18 X5.19 X5.20
OUTF+: F1.2 X5.6 X5.7 X5.8 X5.9 X5.10
PE: C73.2 C74.1 X6.3 ; also sheet 1
POST_OUT+: C69.1 C71.1 C72.+ F1.1 K1.3(-1:NC) Q17.E R77.2 ZD4.C ; also sheet 1,3,5
POST_OUT-: C72.- C75.2 K1.10(-2:NC) Q18.E R83.1 R88.1 X5.11 X5.12 X5.13 X5.14 X5.15 ZD4.A ; also sheet 3,5
RSENSE: Q20.1(G) R97.2 ; also sheet 6
RSENSE_ERR: Q19.C R85.1 ; also sheet 6
SENSE+: K1.4(-1:COM) R80.1 ; also sheet 3
SENSE-: K1.9(-2:COM) R86.2 ; also sheet 3
SENSE_PROT: Q16.C ; also sheet 3
U_SET: IC14.3(NC) IC15.3(A:+IN) ; also sheet 6
U_SET_OUT: IC14.4(COM) ; also sheet 3
V+: C76.1 C77.1 IC15.8(P:V+) IC16.5(P:V+) ; also sheet 2,3,5,6
V-: C79.1 IC16.2(P:V-) ; also sheet 2,3,5

### Notes on the sheet
- Remote sense reverse polarity detection | Power output section | 20-pin power socket
- OUTC+ 1
- 2 OUTC+
- OUTC+ 3
- 5 A quick blow fuse e.g. 179020.5 | 4 OUTC+
- OUTC+ 5
- 6 POST_OUT+
- POST_OUT+ 7
- 8 POST_OUT+
- POST_OUT+ 9
- 10 POST_OUT+
- Output coupling connector (via Backplane PCB) | POST_OUT- 11
- 12 POST_OUT-
- POST_OUT- 13
- 14 POST_OUT-
- POST_OUT- 15
- 16 OUTC-
- OUTC- 17
- 18 OUTC-
- OUTC- 19
- 20 OUTC-
- Remote programming (Voltage / Current) | Remote sense selection
- Rsense polarity protection, Rprog (Volt/Curr)
  Output coupling, Rsense relay
- Licensed under the TAPR Open Hardware License (www.tapr.org/OHL)
- More info at http://www.envox.hr/eez
- Repository: https://github.com/eez-open

## Sheet 5 of 6: CC/CV, OVP
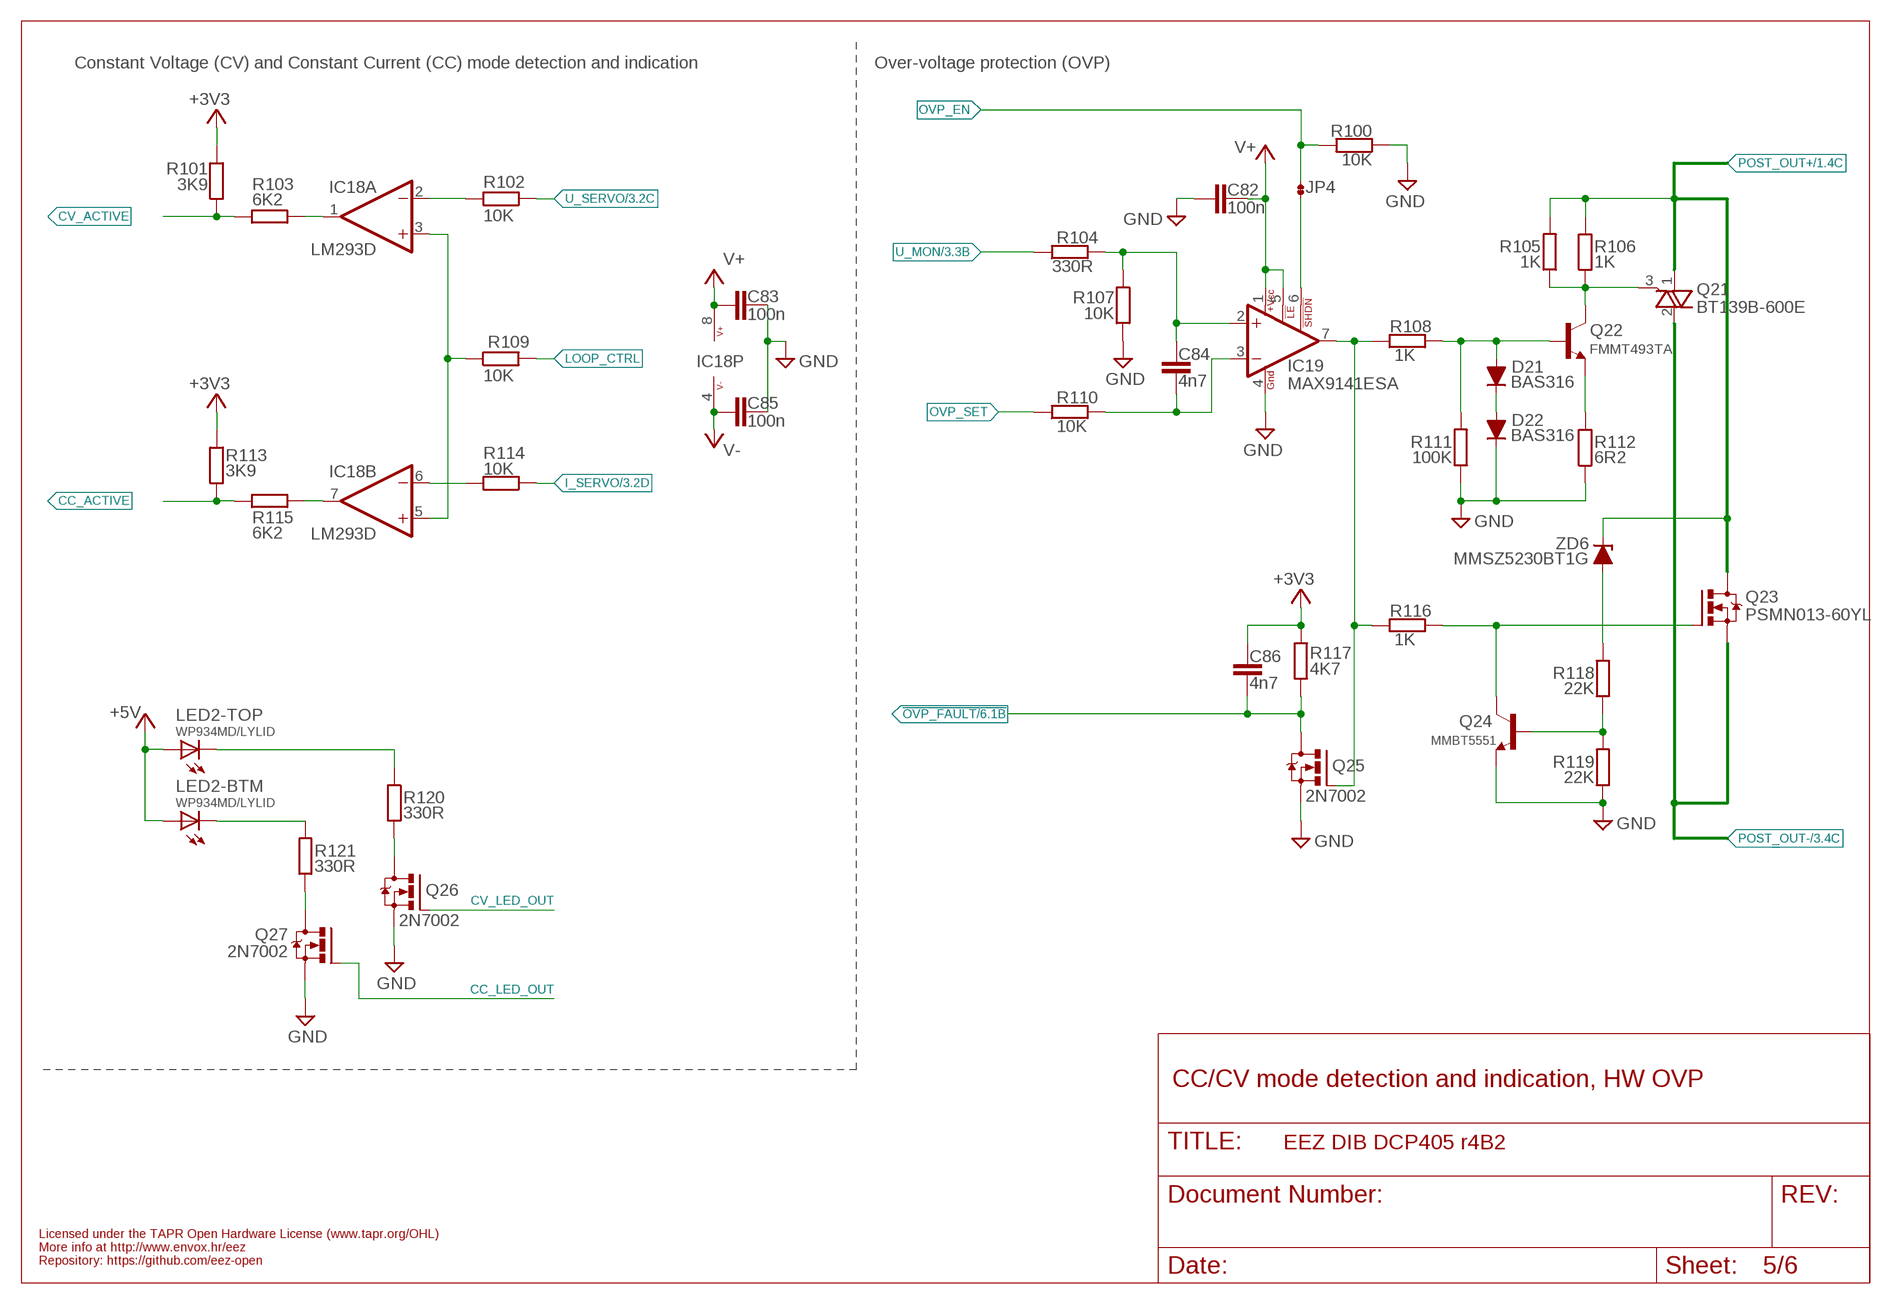
[diagram p4: schematic, sheet 5]

### Parts
C82  100n  C-EUC0603  [C0603]
C83  100n  C-EUC0603  [C0603]
C84  4n7  C-EUC0805  [C0805]
C85  100n  C-EUC0603  [C0603]
C86  4n7  C-EUC0805  [C0805]
D21  BAS316  DIODESOD323R  [SOD323-R]
D22  BAS316  DIODESOD323R  [SOD323-R]
IC18  LM293D  [SOIC127P600X173-8N]
IC19  MAX9141ESA  [SOIC127P600X173-8N]
JP4  JP2-NOCUT-0805  [JP2-0805-NOCUT]
LED2  WP934MD/LYLID  [WP934MD]
Q21  BT139B-600E  BT139  [D2PAK]
Q22  FMMT493TA  MMBT5551LT1-NPN-SOT23-BEC  [SOT23-BEC]
Q23  PSMN013-60YL  N-MOSFETLFPAK  [SOT669]
Q24  MMBT5551  MMBT5551LT1-NPN-SOT23-BEC  [SOT23-BEC]
Q25  2N7002  [SOT103P240X110-3N]
Q26  2N7002  [SOT103P240X110-3N]
Q27  2N7002  [SOT103P240X110-3N]
R100  10K  R-EU_R0805  [R0805]
R101  3K9  R-EU_R0805  [R0805]
R102  10K  R-EU_R0805  [R0805]
R103  6K2  R-EU_R0805  [R0805]
R104  330R  R-EU_R0805  [R0805]
R105  1K  R-EU_R0805  [R0805]
R106  1K  R-EU_R0805  [R0805]
R107  10K  R-EU_R0805  [R0805]
R108  1K  R-EU_R0805  [R0805]
R109  10K  R-EU_R0805  [R0805]
R110  10K  R-EU_R0805  [R0805]
R111  100K  R-EU_R0805  [R0805]
R112  6R2  R-EU_R0805  [R0805]
R113  3K9  R-EU_R0805  [R0805]
R114  10K  R-EU_R0805  [R0805]
R115  6K2  R-EU_R0805  [R0805]
R116  1K  R-EU_R0805  [R0805]
R117  4K7  R-EU_R0805  [R0805]
R118  22K  R-EU_R0805  [R0805]
R119  22K  R-EU_R0805  [R0805]
R120  330R  R-EU_R0805  [R0805]
R121  330R  R-EU_R0805  [R0805]
ZD6  MMSZ5230BT1G  ZENER-DIODESOD123  [SOD123]

### Nets
!OVP_FAULT: C86.2 Q25.3(D) R117.2 ; also sheet 6
+3V3: C86.1 R101.2 R113.2 R117.1 ; also sheet 2,3,4,6
+5V: LED2.BA(-BTM:A) LED2.TA(-TOP:A) ; also sheet 2,4,6
CC_ACTIVE: R113.1 R115.2 ; also sheet 6
CC_LED: LED2.BC(-BTM:C) R121.2
CC_LED_OUT: Q27.1(G) ; also sheet 6
CV_ACTIVE: R101.1 R103.2 ; also sheet 6
CV_LED_OUT: Q26.1(G) ; also sheet 6
D_CC: Q27.3(D) R121.1
D_CV: Q26.3(D) R120.2
GND: C82.1 C83.1 C85.1 D22.C IC19.4(GND) Q24.E Q25.2(S) Q26.2(S) Q27.2(S) R100.1 R107.2 R111.1 R112.1 R119.1 ; also sheet 1,2,3,4,6
I_SERVO: R114.1 ; also sheet 3
LOOP_CTRL: R109.2 ; also sheet 3
N$1: IC19.6(!SHDN) JP4.2
N$3: LED2.TC(-TOP:C) R120.1
N$13: IC19.7(OUT) Q25.1(G) R108.2 R116.2
N$18: Q21.3(G) Q22.C R105.1 R106.1
N$19: Q22.E R112.2
N$20: D21.C D22.A
N$21: D21.A Q22.B R108.1 R111.2
N$24: R118.2 ZD6.A
N$28: Q24.B R118.1 R119.2
N$30: IC18.1(A:OUT) R103.1
N$33: IC18.7(B:OUT) R115.1
N$44: Q23.4(G) Q24.C R116.1
N$70: IC18.3(A:+IN) IC18.5(B:+IN) R109.1
N$1693: IC18.2(A:-IN) R102.2
N$1694: IC18.6(B:-IN) R114.2
OVP_EN: JP4.1 R100.2 ; also sheet 6
OVP_IN+: C84.1 IC19.2(+IN) R104.2 R107.1
OVP_IN-: C84.2 IC19.3(-IN) R110.2
OVP_SET: R110.1 ; also sheet 6
POST_OUT+: Q21.1(A1) Q23.MB(D) R105.2 R106.2 ZD6.C ; also sheet 1,3,4
POST_OUT-: Q21.2(A2) Q23.1(S) Q23.2(S) Q23.3(S) ; also sheet 3,4
U_MON: R104.1 ; also sheet 3,6
U_SERVO: R102.1 ; also sheet 3
V+: C82.2 C83.2 IC18.8(P:V+) IC19.1(+VCC) IC19.5(!LE) ; also sheet 2,3,4,6
V-: C85.2 IC18.4(P:V-) ; also sheet 2,3,4

### Notes on the sheet
- Constant Voltage (CV) and Constant Current (CC) mode detection and indication | Over-voltage protection (OVP)
- CC/CV mode detection and indication, HW OVP
- Licensed under the TAPR Open Hardware License (www.tapr.org/OHL)
- More info at http://www.envox.hr/eez
- Repository: https://github.com/eez-open

## Sheet 6 of 6: Digital control, Vref
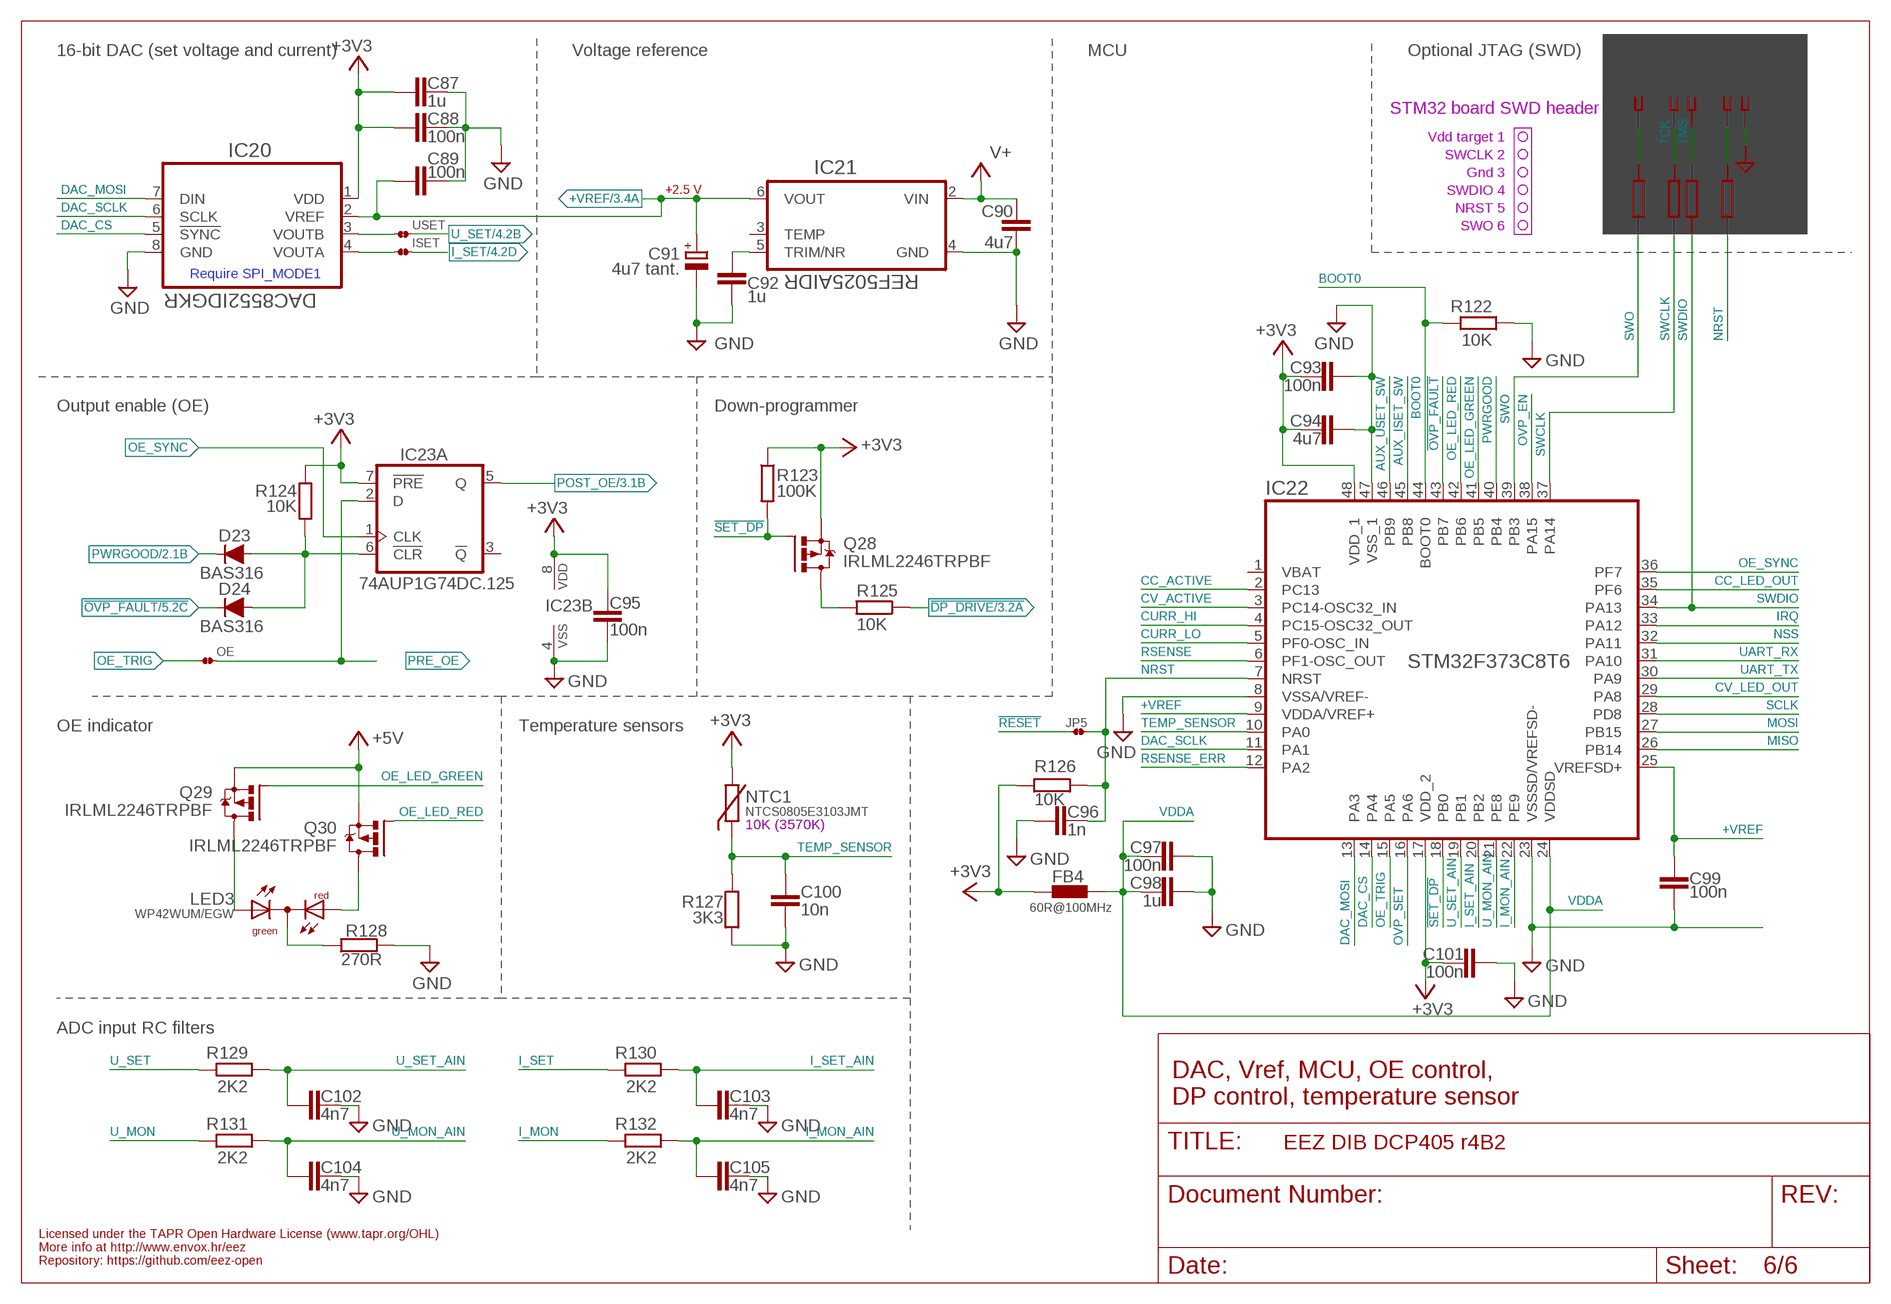
[diagram p5: schematic, sheet 6]

### Parts
C87  1u  C-EUC0805  [C0805]
C88  100n  C-EUC0603  [C0603]
C89  100n  C-EUC0603  [C0603]
C90  4u7  C-EUC1206  [C1206]
C91  4u7 tant.  ECAP1206  [EC1206]
C92  1u  C-EUC0805  [C0805]
C93  100n  C-EUC0603  [C0603]
C94  4u7  C-EUC1206  [C1206]
C95  100n  C-EUC0603  [C0603]
C96  1n  C-EUC0805  [C0805]
C97  100n  C-EUC0603  [C0603]
C98  1u  C-EUC0805  [C0805]
C99  100n  C-EUC0603  [C0603]
C100  10n  C-EUC0805  [C0805]
C101  100n  C-EUC0603  [C0603]
C102  4n7  C-EUC0805  [C0805]
C103  4n7  C-EUC0805  [C0805]
C104  4n7  C-EUC0805  [C0805]
C105  4n7  C-EUC0805  [C0805]
D23  BAS316  DIODESOD323R  [SOD323-R]
D24  BAS316  DIODESOD323R  [SOD323-R]
FB4  60R@100MHz  FERRITE_BEAD0603  [BEAD0603]
IC20  DAC8552IDGKR  DAC8552_DGK_8M  [DGK8-M]
IC21  REF5025AIDR  REF50XX  [SOIC127P600X175-8N]
IC22  STM32F373C8T6  [LQFP-48]
IC23  74AUP1G74DC.125  SN74LVC1G74DCTR-VSSOP  [DCU8]
ISET  JP2-NOCUT-0805  [JP2-0805-NOCUT]
JP5  JP2-NOCUT-0805  [JP2-0805-NOCUT]
LED3  WP42WUM/EGW  LED_L-42WUM/1EGWT  [L-42WUM-1EGWT]
NTC1  NTCS0805E3103JMT  NTCR_0805  [R_0805]
OE  JP2-NOCUT-0805  [JP2-0805-NOCUT]
Q28  IRLML2246TRPBF  [SOT95P237X112-3N]
Q29  IRLML2246TRPBF  [SOT95P237X112-3N]
Q30  IRLML2246TRPBF  [SOT95P237X112-3N]
R122  10K  R-EU_R0805  [R0805]
R123  100K  R-EU_R0805  [R0805]
R124  10K  R-EU_R0805  [R0805]
R125  10K  R-EU_R0805  [R0805]
R126  10K  R-EU_R0805  [R0805]
R127  3K3  R-EU_R0805  [R0805]
R128  270R  R-EU_R0805  [R0805]
R129  2K2  R-EU_R0805  [R0805]
R130  2K2  R-EU_R0805  [R0805]
R131  2K2  R-EU_R0805  [R0805]
R132  2K2  R-EU_R0805  [R0805]
RN2  N.C.  R_ARRAY4  [CAY16]
USET  JP2-NOCUT-0805  [JP2-0805-NOCUT]
X7  N.C.  SSW-106-02-S-S  [SSW-106-02-S-S]

### Nets
!DP_DRIVE: R125.1 ; also sheet 3
!OVP_FAULT: D24.C IC22.43(PB7) ; also sheet 5
!RESET: JP5.1 ; also sheet 2
!SET_DP: IC22.18(PB0) Q28.1(G) R123.2
+3V3: C87.1 C88.2 C93.2 C94.1 C95.2 C101.2 FB4.P$1 IC20.1(VDD) IC22.17(VDD_2) IC22.48(VDD_1) IC23.7(A:!PRE) IC23.8(B:VDD) NTC1.1 Q28.2(S) R123.1 R124.1 R126.1 ; also sheet 2,3,4,5
+5V: Q29.2(S) Q30.2(S) ; also sheet 2,4,5
+VREF: C89.2 C91.+ C99.2 IC20.2(VREF) IC21.6(VOUT) IC22.9(VDDA/VREF+) IC22.25(VREFSD+) ; also sheet 3
AUX_ISET_SW: IC22.45(PB8) ; also sheet 4
AUX_USET_SW: IC22.46(PB9) ; also sheet 4
BOOT0: IC22.44(BOOT0) R122.2 ; also sheet 2
CC_ACTIVE: IC22.2(PC13) ; also sheet 5
CC_LED_OUT: IC22.35(PF6) ; also sheet 5
CURR_HI: IC22.4(PC15-OSC32_OUT) ; also sheet 3
CURR_LO: IC22.5(PF0-OSC_IN) ; also sheet 3
CV_ACTIVE: IC22.3(PC14-OSC32_IN) ; also sheet 5
CV_LED_OUT: IC22.29(PA8) ; also sheet 5
DAC_CS: IC20.5(!SYNC) IC22.14(PA4)
DAC_MOSI: IC20.7(DIN) IC22.13(PA3)
DAC_SCLK: IC20.6(SCLK) IC22.11(PA1)
DP_LED: Q28.3(D) R125.2
GND: C87.2 C88.1 C89.1 C90.2 C91.- C92.2 C93.1 C94.2 C95.1 C96.2 C97.1 C98.1 C99.1 C100.1 C101.1 C102.1 C103.1 C104.1 C105.1 IC20.8(GND) IC21.4(GND) IC22.8(VSSA/VREF-) IC22.23(VSSSD/VREFSD-) IC22.47(VSS_1) IC23.4(B:VSS) R122.1 R127.2 R128.2 X7.3 ; also sheet 1,2,3,4,5
I_MON: R132.2 ; also sheet 3
I_MON_AIN: C105.2 IC22.22(PE9) R132.1
I_SET: ISET.2 R130.2 ; also sheet 4
I_SET_AIN: C103.2 IC22.20(PB2) R130.1
IRQ: IC22.33(PA12) ; also sheet 2
MISO: IC22.26(PB14) ; also sheet 2
MOSI: IC22.27(PB15) ; also sheet 2
N$12: LED3.CC(C) R128.1
N$15: LED3.RED(AR) Q30.3(D)
N$22: LED3.GREEN(AG) Q29.3(D)
N$23: IC20.3(VOUTB) USET.1
N$27: IC20.4(VOUTA) ISET.1
N$56: D23.A D24.A IC23.6(A:!CLR) R124.2
N$71: C92.1 IC21.5(TRIM/NR)
N$161: RN2.8 X7.6
N$170: RN2.6 X7.5
NRST: C96.1 IC22.7(NRST) JP5.2 R126.2 RN2.3
NSS: IC22.32(PA11) ; also sheet 2
OE_LED_GREEN: IC22.41(PB5) Q29.1(G)
OE_LED_RED: IC22.42(PB6) Q30.1(G)
OE_SYNC: IC22.36(PF7) IC23.1(A:CLK) ; also sheet 2
OE_TRIG: IC22.15(PA5) OE.1
OVP_EN: IC22.38(PA15) ; also sheet 5
OVP_SET: IC22.16(PA6) ; also sheet 5
POST_OE: IC23.5(A:Q) ; also sheet 3
PRE_OE: IC23.2(A:D) OE.2 ; also sheet 1
PWRGOOD: D23.C IC22.40(PB4) ; also sheet 2
RSENSE: IC22.6(PF1-OSC_OUT) ; also sheet 4
RSENSE_ERR: IC22.12(PA2) ; also sheet 4
SCLK: IC22.28(PD8) ; also sheet 2
SWCLK: IC22.37(PA14) RN2.2
SWDIO: IC22.34(PA13) RN2.4
SWO: IC22.39(PB3) RN2.1
TCK: RN2.7 X7.2
TEMP_SENSOR: C100.2 IC22.10(PA0) NTC1.2 R127.1
TMS: RN2.5 X7.4
U_MON: R131.2 ; also sheet 3,5
U_MON_AIN: C104.2 IC22.21(PE8) R131.1
U_SET: R129.2 USET.2 ; also sheet 4
U_SET_AIN: C102.2 IC22.19(PB1) R129.1
UART_RX: IC22.31(PA10) ; also sheet 2
UART_TX: IC22.30(PA9) ; also sheet 2
V+: C90.1 IC21.2(VIN) ; also sheet 2,3,4,5
VDDA: C97.2 C98.2 FB4.P$2 IC22.24(VDDSD)
Unconnected: IC21.3(TEMP) IC22.1(VBAT) IC23.3(A:!Q) X7.1

### Notes on the sheet
- 16-bit DAC (set voltage and current) | Voltage reference | MCU | Optional JTAG (SWD)
- STM32 board SWD header
- Vdd target 1
- SWCLK 2
- Gnd 3
- SWDIO 4
- +2.5 V
- NRST 5
- SWO 6
- Require SPI_MODE1
- Output enable (OE) | Down-programmer
- OE indicator | Temperature sensors
- 10K (3570K)
- ADC input RC filters
- DAC, Vref, MCU, OE control,
  DP control, temperature sensor
- Licensed under the TAPR Open Hardware License (www.tapr.org/OHL)
- More info at http://www.envox.hr/eez
- Repository: https://github.com/eez-open

## Library data of the parts
C1-C3 C5-C7 C7A C8-C14 C17-C71 C73-C90 C92-C105 = rcl:C-EU: CAPACITOR, European symbol
C4 C15 C16 C72 C91 = EEZ_Lib1:ECAP
D1 D3 D17-D24 = EEZ_Lib1:DIODE
D2 D4-D7 D15 = EEZ_Lib1:SCHOTTKY
D8-D14 D16 = diode:DIODE-: DIODE
DIB1.1 = EEZ_Lib1:JP3-CUT
F1 = EEZ_Lib1:ZH32: Fuse holder with cover; tube fuses; 5x20mm
FB1-FB4 = EEZ_Lib1:FERRITE_BEAD: FAIR-RITE - 2506033007Y3 - FERRITE BEAD, 0.04OHM, 3A, 0603 Farnell: 2112873
FM1-FM3 = EEZ_Lib1:FIDUCIAL: Fiducial mark for pick and place automation
GND = EEZ_Lib1:PCB_TEST_TAB
IC1 = EEZ_TI:LM5145: 6-V to 75-V Synchronous Buck DC-DC Controller With Wide Duty Cycle Range
IC2 = EEZ_Lib1:TPS54060: 0.5A, 60V Step Down SWIFT DC/DC Converter with ECO-MODE,MSOP-10; MPN: TPS54060ADGQ; OC_FARNELL: 2099922; OC_NEWARK: 05W5854; PACKAGE: MSOP-10; SUPPLIER: TEXAS INSTRUMENTS
IC3 = EEZ_Lib1:SI8662: Low power 6-ch digital isolator (4+2) Farnell: 2423351
IC4 = EEZ_Lib1:MC78LXX: μA78L00 series positive voltage regulators
IC5 = EEZ_DIB:LP2985: 150-mA Low-noise Low-dropout Regulator With Shutdown
IC6 = EEZ_Lib1:MC79LXX: 3-terminal negative voltage regulator, up to 100mA
IC7 = EEZ_Lib1:SI8641: Low power 4-ch digital isolator (3+1) Farnell: 2423288
IC8 = EEZ_Lib1:AT24CXX: I2C-Compatible (2-wire) Serial EEPROM
IC9 IC10 = EEZ_Lib1:TL072
IC11 = EEZ_Lib1:OP27GSZ: Low Noise, Precision Operational Amplifier
IC12 IC14 IC17 = EEZ_Lib1:SN74LVC1G3157
IC13 = EEZ_TI:SN74LVC2G08: Dual 2-Input Positive-AND Gate
IC15 IC18 = EEZ_Lib1:LM293: Dual Differential Comparators
IC16 = EEZ_TI:OPA376A: Low-Noise, Low Quiescent Current, Precision Operational Amplifier
IC19 = EEZ_Lib1:MAX9141: 40ns, Low-Power, 3V/5V, Rail-to-Rail Single-Supply Comparator
IC20 = EEZ_Lib1:DAC8552_DGK_8
IC21 = EEZ_Lib1:REF50XX: Low-Noise (3μVpp/V), Very Low Drift (max. 8ppm/°C), Precision Voltage Reference Pin compatible with REF2 Farnell: 1439628
IC22 = EEZ_DIB:STM32F373: ARM®Cortex®-M4 32b MCU+FPU
IC23 = EEZ_Lib1:SN74LVC1G74DCTR: Single Positive-Edge-Triggered D-Type Flip-Flop with Clear and Preset
ISET JP2-JP5 OE USET = EEZ_Lib1:JP2-NOCUT
J1 = EEZ_connectors:PCB_TAB: PCB quick-fit terminal
J2 J3 = EEZ_connectors:BINDING_POST: Various 4 mm binding posts
JP1 = EEZ_Lib1:JP2-CUT
K1 = EEZ_switches:FTR-C1: Power relay, 2 poles, 2A high insulation/wide gap
KK1 KK2 = EEZ_Lib1:PCB-MB: Richo Mounting Block; 16 x 6 mm
KK3 = EEZ_Lib1:SK96/84
L1 = EEZ_Lib1:RN112
L2 = EEZ_inductors_and_transformers:PANASONIC_ETQ-P4_KFM: Panasonic power choke coil automative grade 7.4x7.4mm
L3 = EEZ_inductors_and_transformers:COILCRAFT_HPI0630: High power inductor
LED1 LED2 = EEZ_Lib1:WP934MD: Kingbright LED; in housing; 3mm; No.of diodes:2
LED3 = EEZ_Lib1:LED_L-42WUM/1EGWT: 3 mm right angle bicolor LED indicator
NTC1 = EEZ_Lib1:NTC
OK1 = EEZ_Lib1:TLP291: Toshiba Photocopler GaAs IRED & Photo-transistor
OSHWA = EEZ_Lib1:OSHWA-CERT
Q1 Q2 Q5 Q14 Q15 Q23 = EEZ_Lib1:N-MOSFET
Q3 Q6 Q10 Q11 Q17 = transistor:*-PNP-: PNP Transistror
Q4 Q20 Q25-Q27 = EEZ_Lib1:2N7002: N-CHANNEL ENHANCEMENT MODE FIELD EFFECT TRANSISTOR; MPN: 2N7002-7-F; OC_FARNELL: 1713823; OC_NEWARK: 25R5679; PACKAGE: SOT-23-3; SUPPLIER: DIODES INC.
Q7 Q9 = EEZ_Lib1:BCP56: Low power NPN Transistor, Vceo=80V, Ic=1A, SOT-223
Q8 = EEZ_Lib1:P-MOSFET: HEXFET Power MosFet Source: http://www.irf.com/
Q12 Q13 Q16 Q18 Q19 Q22 Q24 = transistor:*-NPN-: NPN Transistror BF959 corrected 2008.03.06
Q21 = EEZ_Lib1:BT139: 4Q Triac
Q28-Q30 = EEZ_Lib1:IRLML2246TRPBF: HEXFET Power MOSFET (-20V, -2.6A); MPN: IRLML2246TRPBF; OC_FARNELL: 1888166; OC_NEWARK: 40T7450; PACKAGE: SOT-3; SUPPLIER: International Rectifier; TME: IRLML2246TRPBF
R1-R28 R30-R68 R70-R132 = rcl:R-EU_: RESISTOR, European symbol
R29 = EEZ_Lib1:R_EU: RESISTOR - European symbol
R69 = EEZ_Lib1:R-EU_4WIRE
RN1 RN2 = EEZ_Lib1:R_ARRAY4: 1206 four resistor array
SH1 SH2 = EEZ_Lib1:SHORT
TP1-TP4 = EEZ_connectors:TEST-PIN: Test pin
TR1 = EEZ_inductors_and_transformers:BOURNS_SRF0703INV: Bourns SRF0703 Series - Dual-Winding Shielded Power Inductors
X1 = EEZ_connectors:MINIFIT_39301020: Molex Socket; wire-board; male; Mini-Fit Jr; 4.2mm; PIN:2; THT; PCB snap
X2 X3 = con-samtec:SSW-105-02-S-D: THROUGH-HOLE .025" SQ POST SOCKET Source: Samtec SSW.pdf; MPN: SSW-105-02-S-D; OC_FARNELL: unknown; OC_NEWARK: 11P9398
X4 = EEZ_connectors:77317-104-28LF: Headers & Wire Housings 28P right angle 0.1" pitch
X5 = EEZ_connectors:SSW-110-02-T-D-RA: Samtec SSW-113-02-T-D-RA Receptacle, 2.54MM, RA, 20-way
X6 = EEZ_connectors:MC1,5/5-G-3,5: Pluggable Terminal Blocks, angled, 5-pin 3.5mm pitch Through Hole Header
X7 = con-samtec:SSW-106-02-S-S: THROUGH-HOLE .025" SQ POST SOCKET Source: Samtec SSW.pdf; MPN: SSW-106-02-S-S; OC_FARNELL: unknown; OC_NEWARK: 11P9416
ZD1 ZD4 = EEZ_Lib1:P6SMB68A: Transient Voltage Suppression Diodes, DO-214AA
ZD2 ZD3 ZD6 = EEZ_Lib1:ZENER-DIODE
ZD5 = EEZ_Lib1:SLVU2.8: 2.8Volts ESD Protection Devices

## Net classes
0 default: width 0.203 mm, drill 0.3 mm, clearance 0.203 mm
1 lvds: width 0.152 mm, drill 0.3 mm, clearance 0.152 mm to class 0, clearance 0.152 mm
2 gnd: width 0.254 mm, drill 0.584 mm, clearance 0.254 mm